# EAGLE design kiwi-basic (EAGLE 7.4.0)
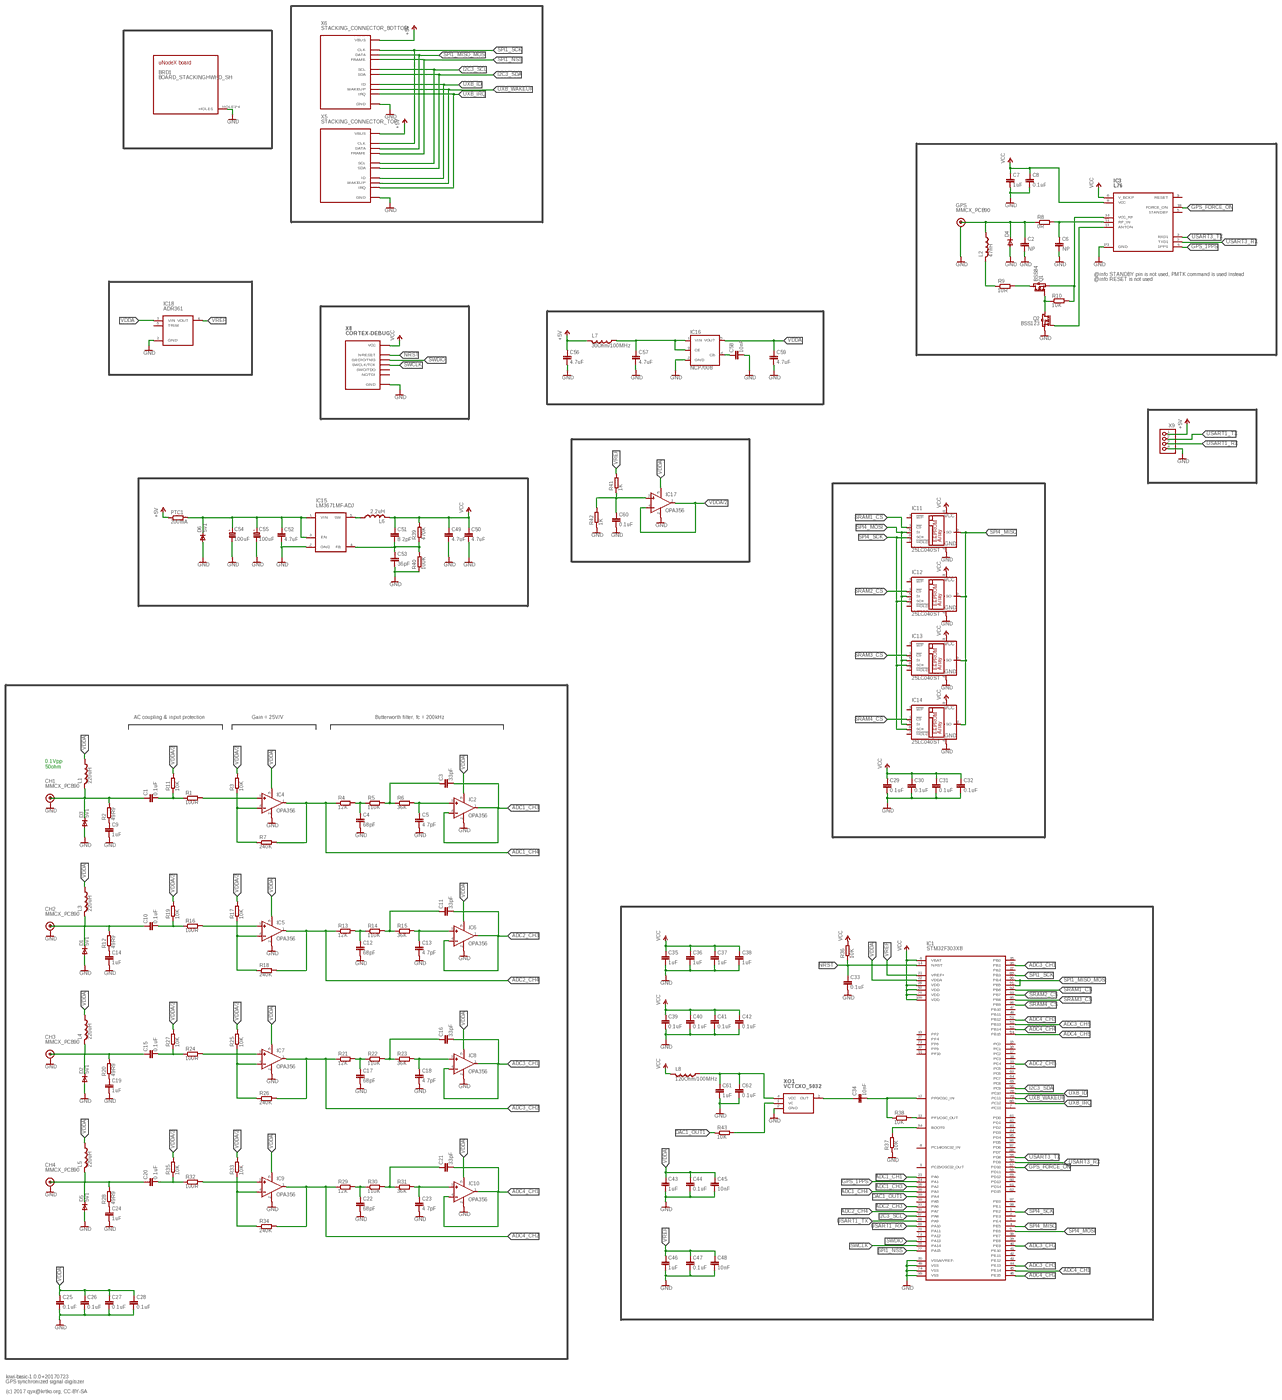
[diagram p0: schematic, sheet 1, overview]
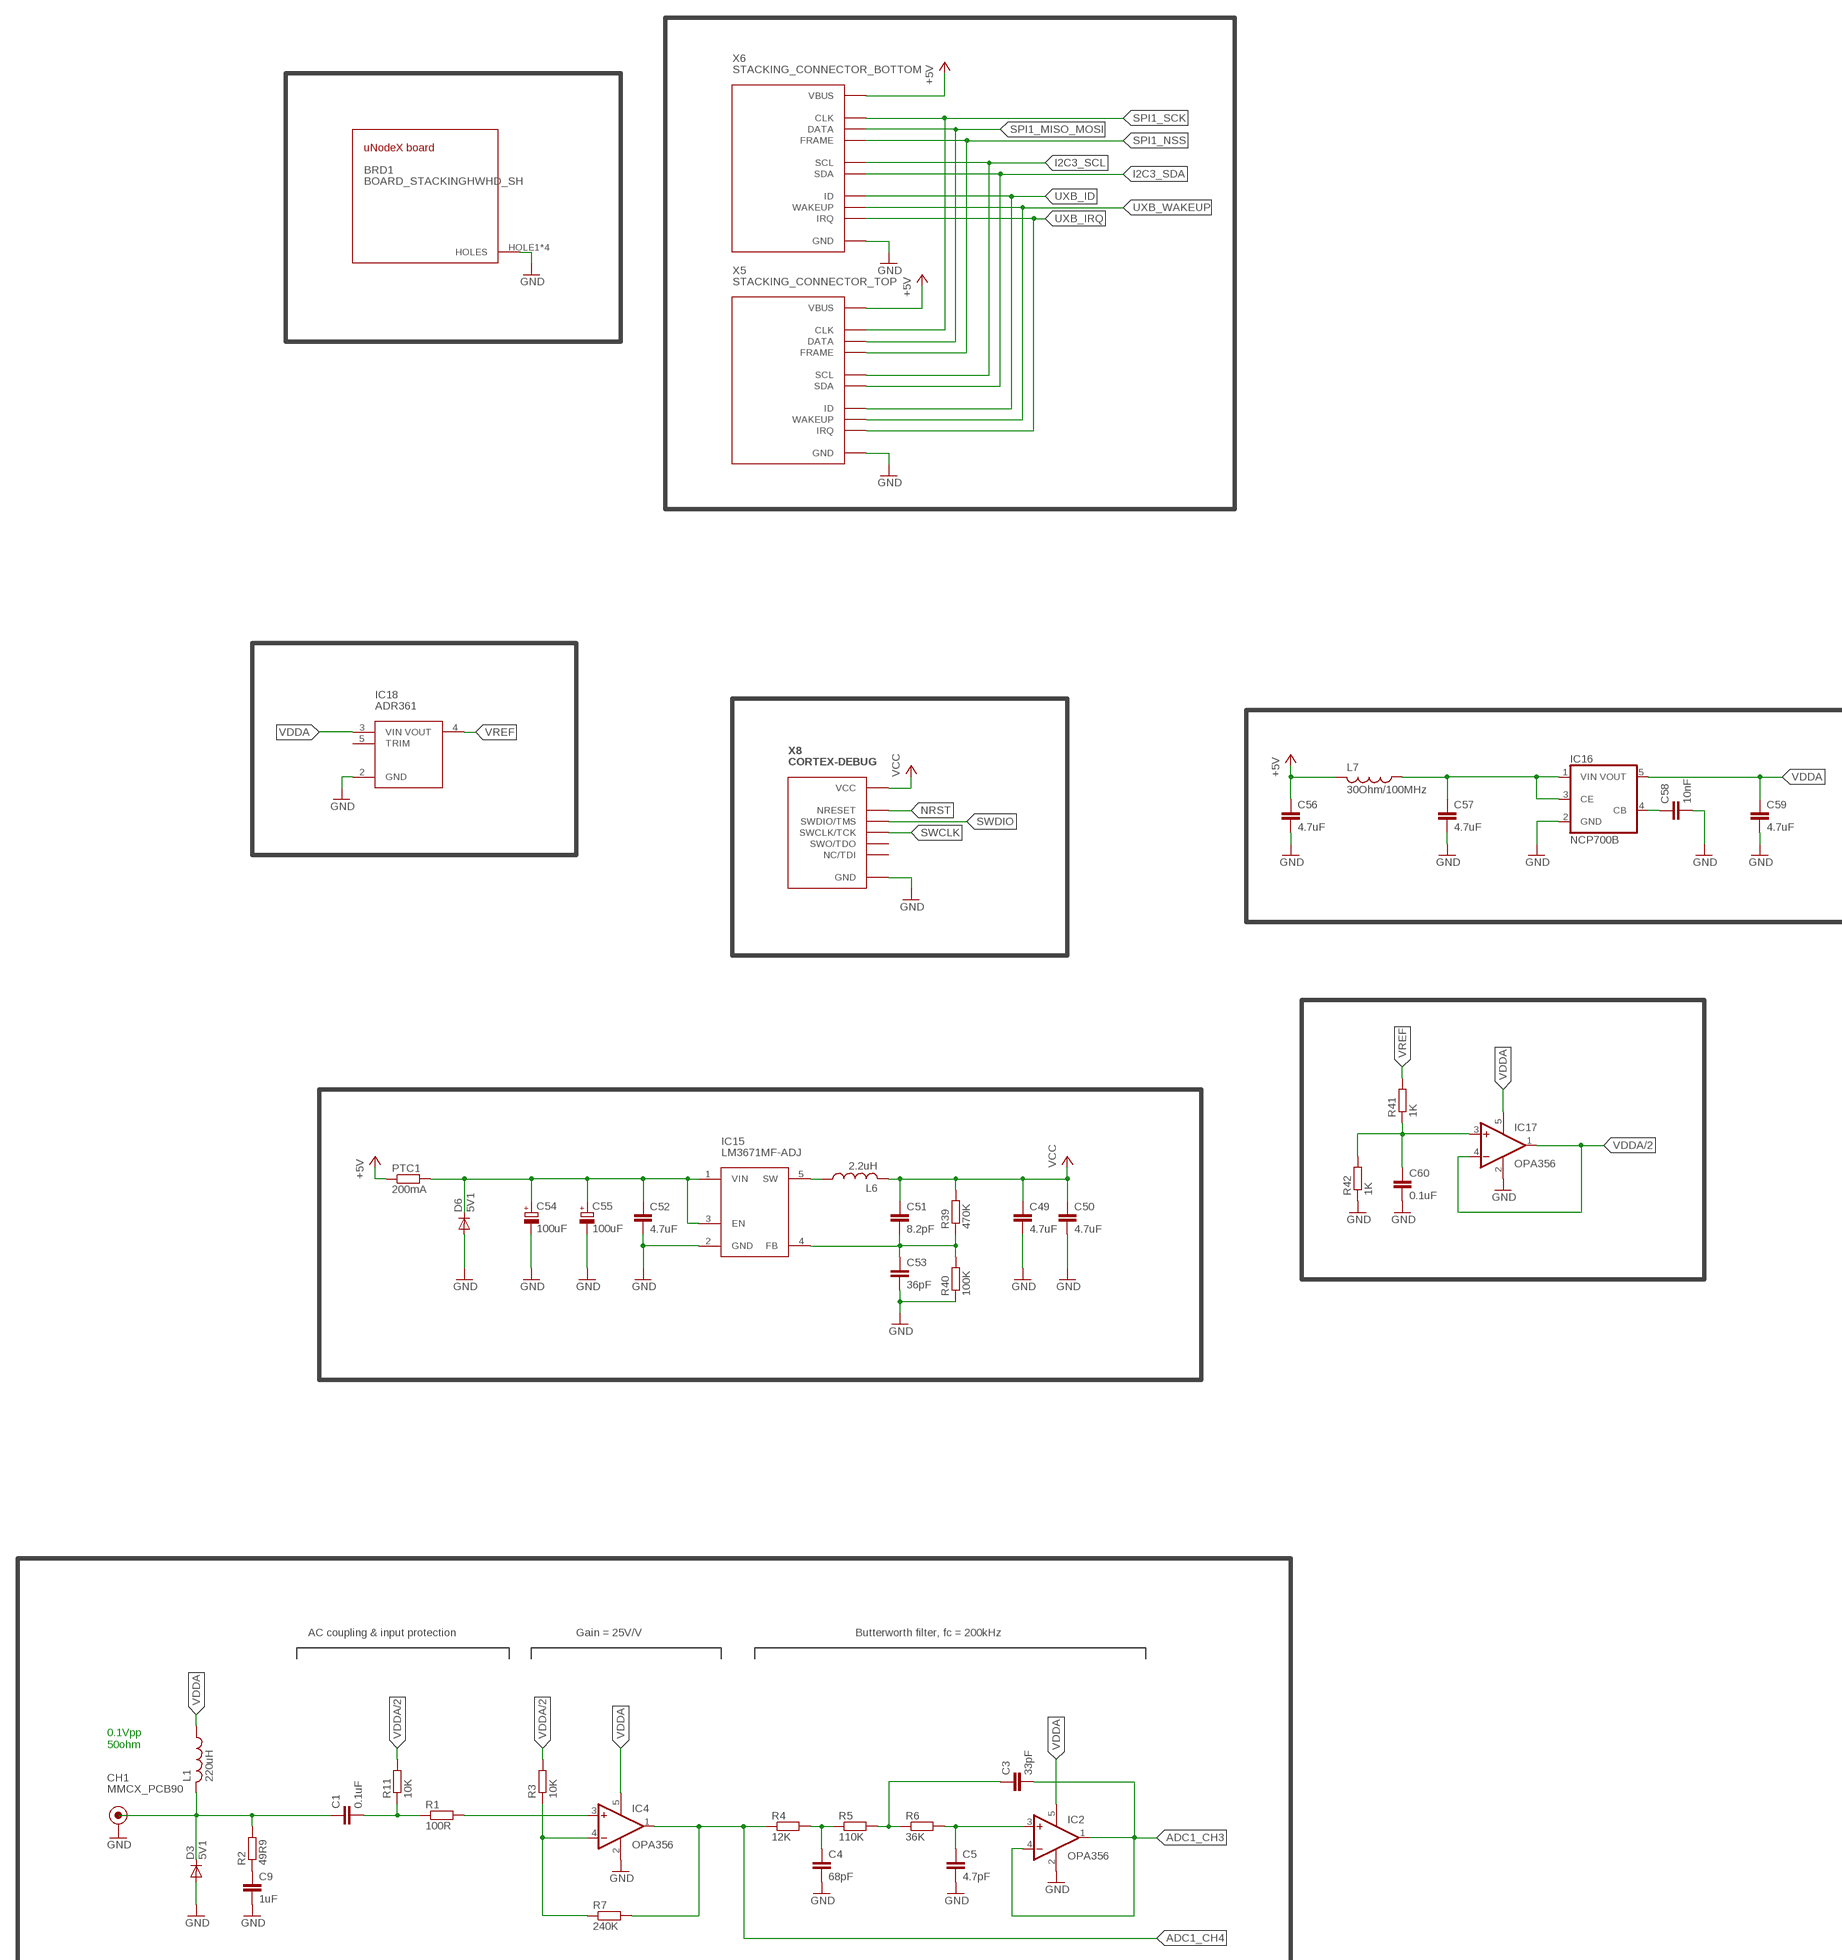
[diagram p1: schematic, sheet 1, part 1 of 4]
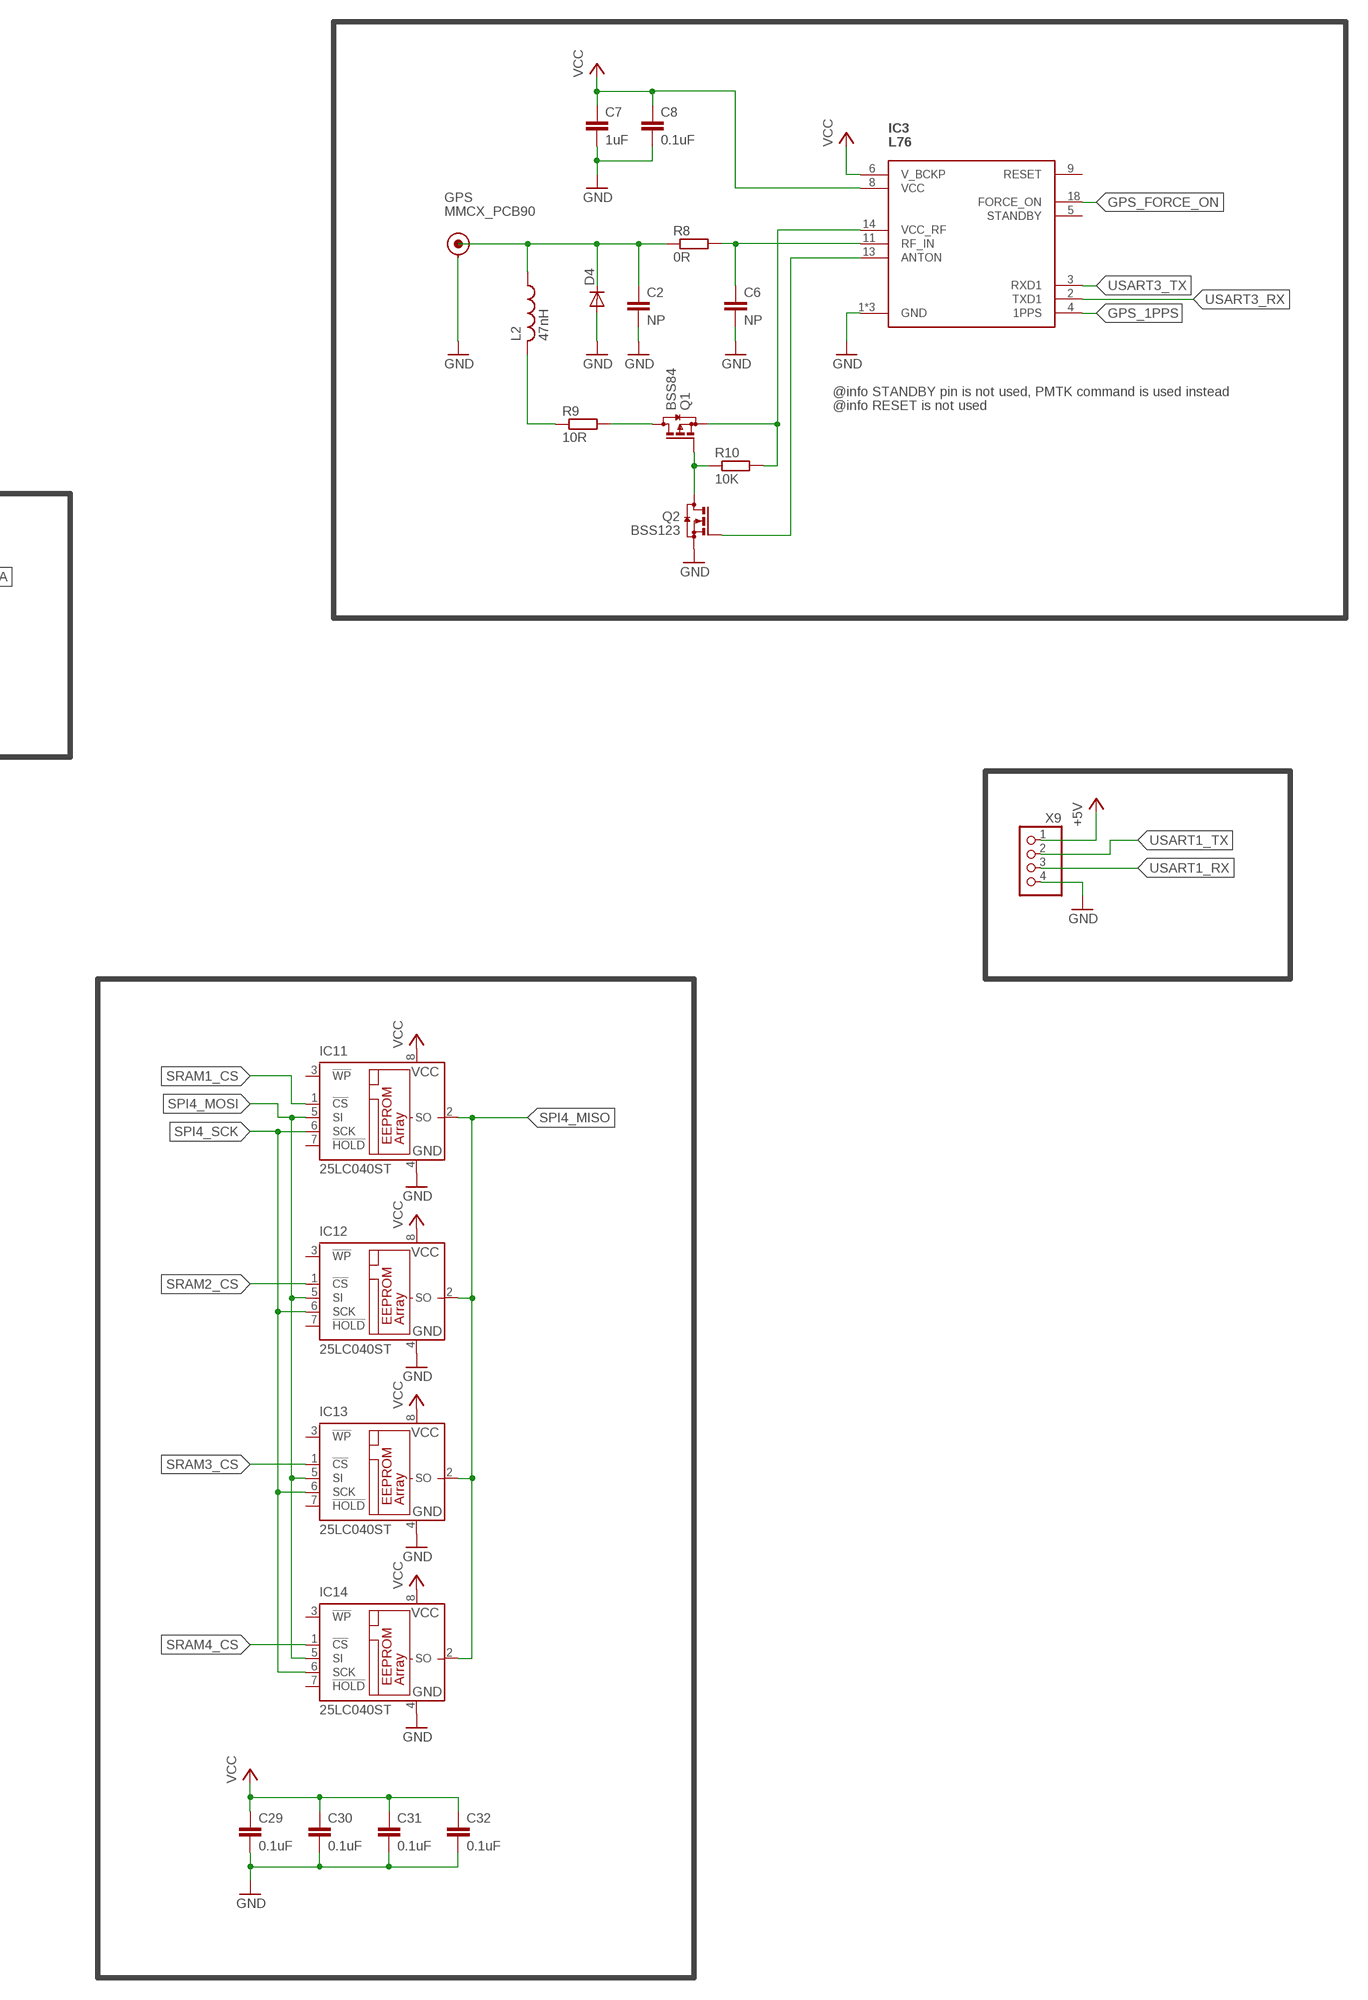
[diagram p2: schematic, sheet 1, part 2 of 4]
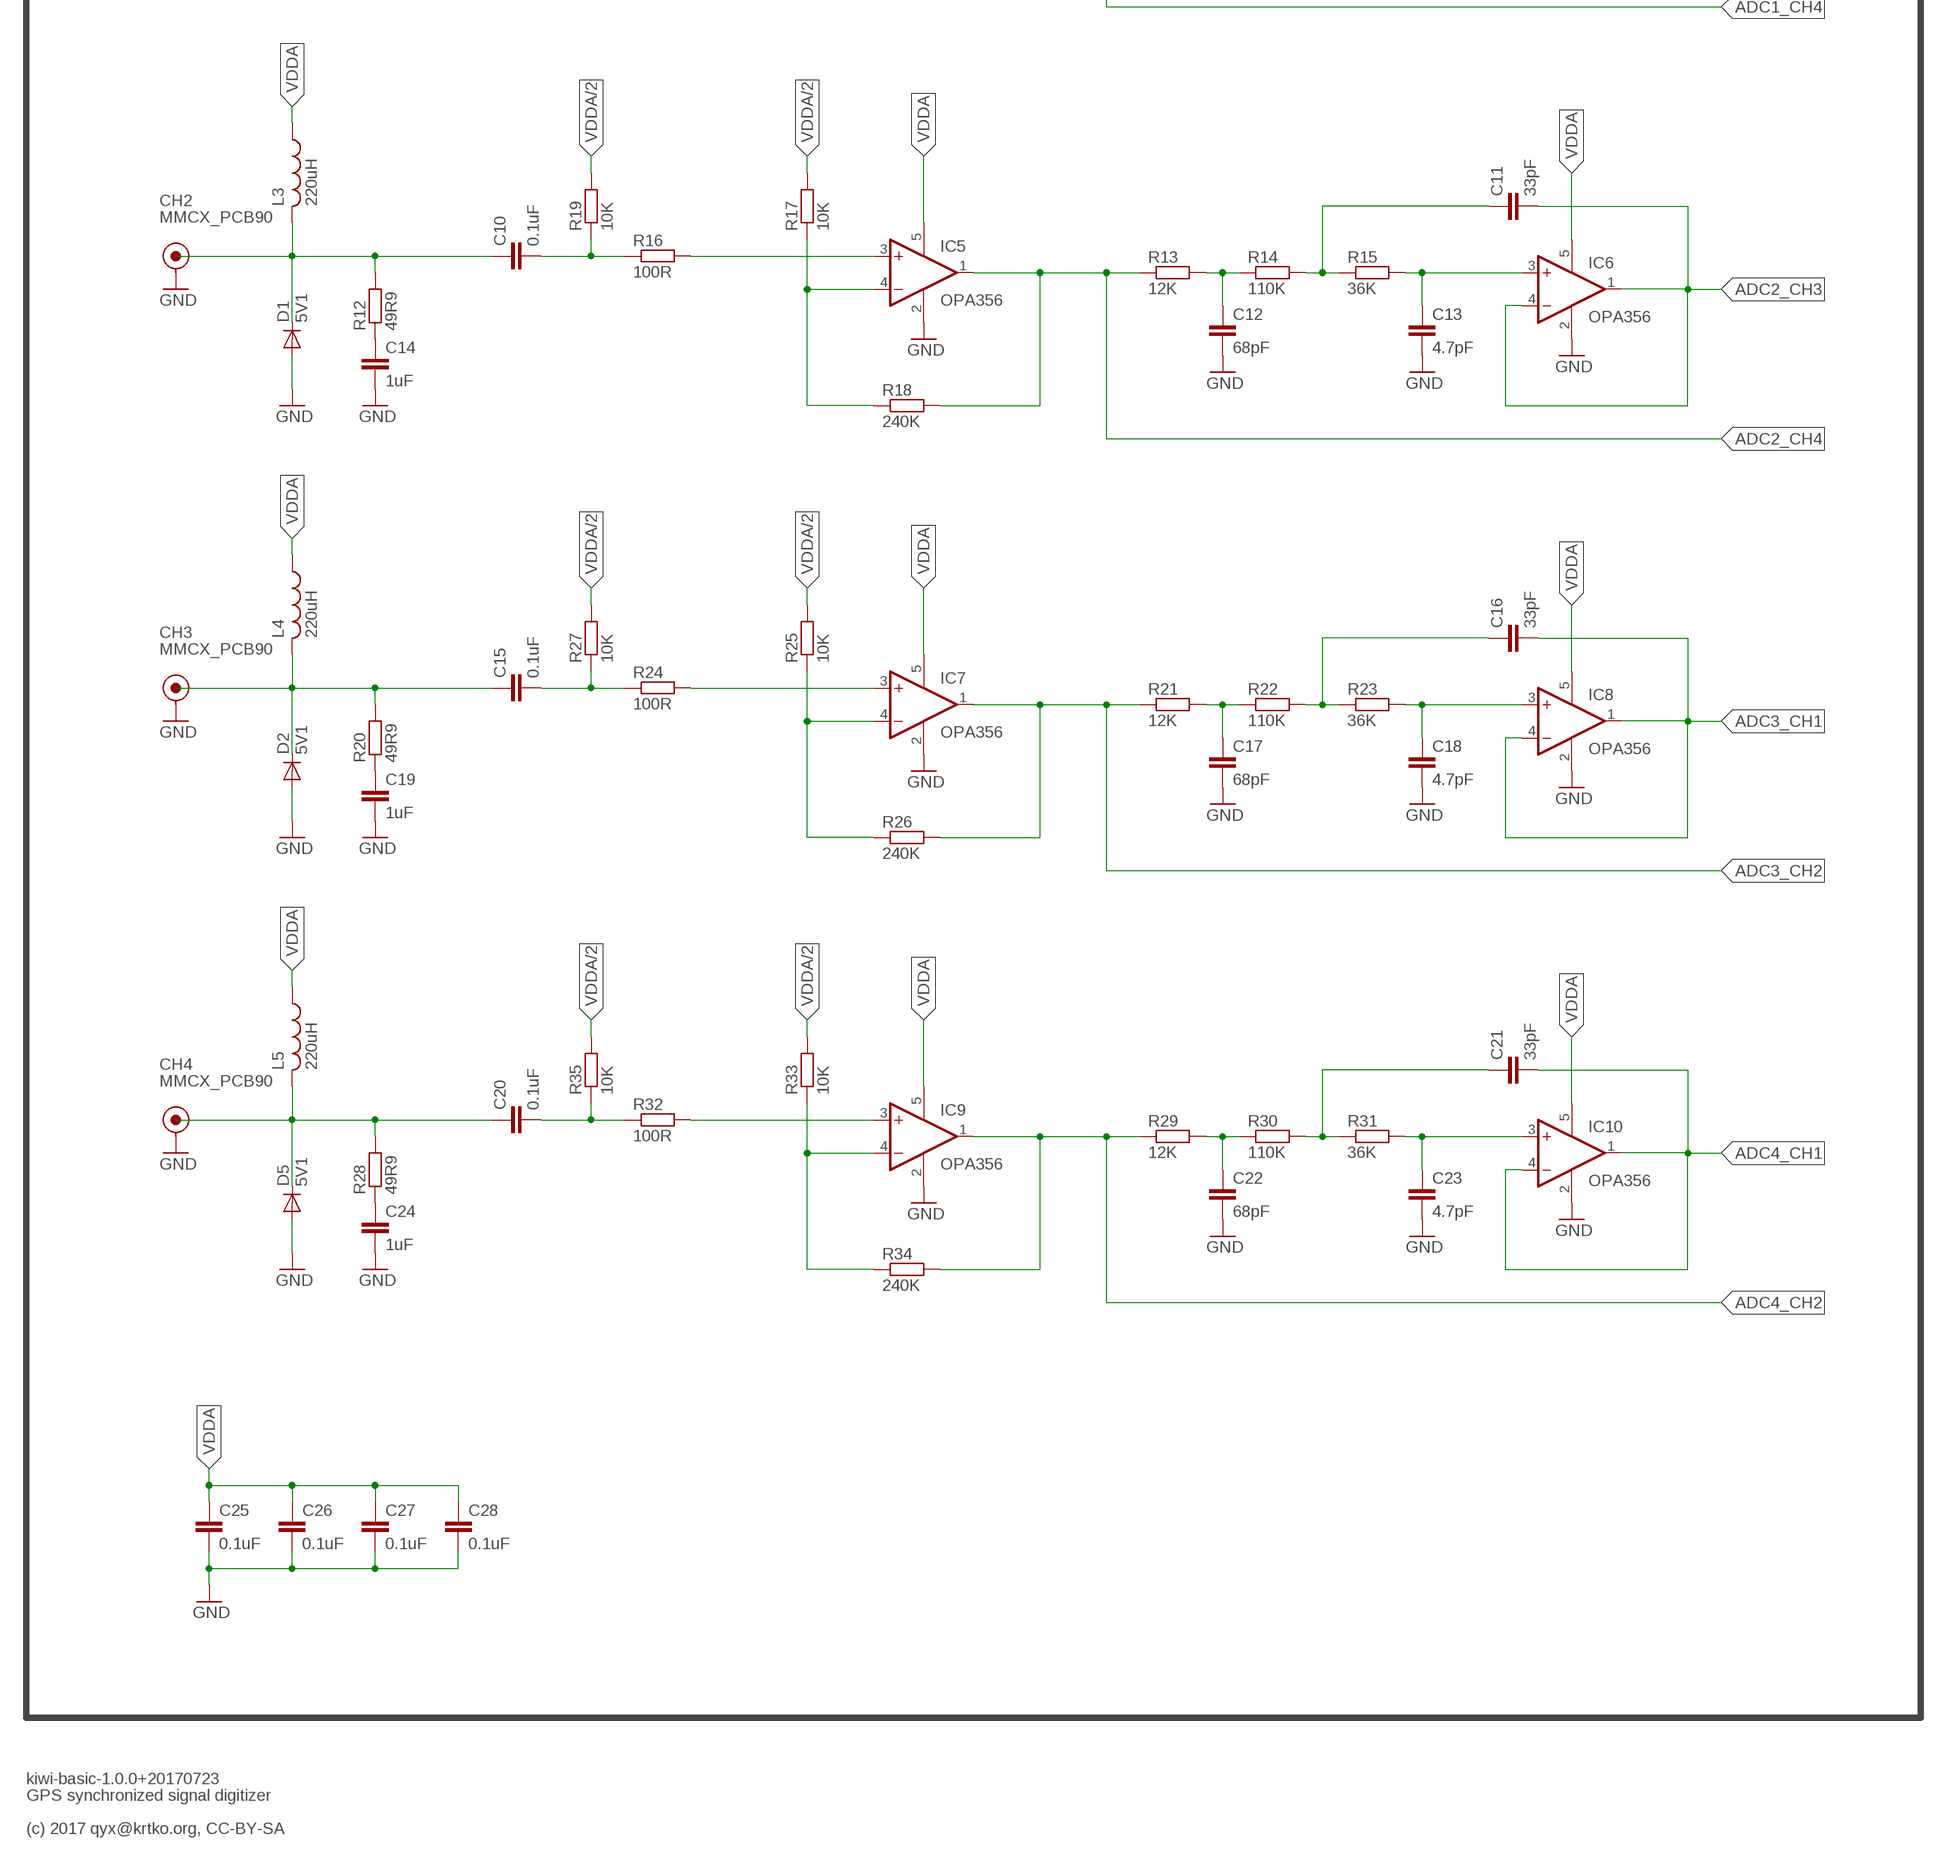
[diagram p3: schematic, sheet 1, part 3 of 4]
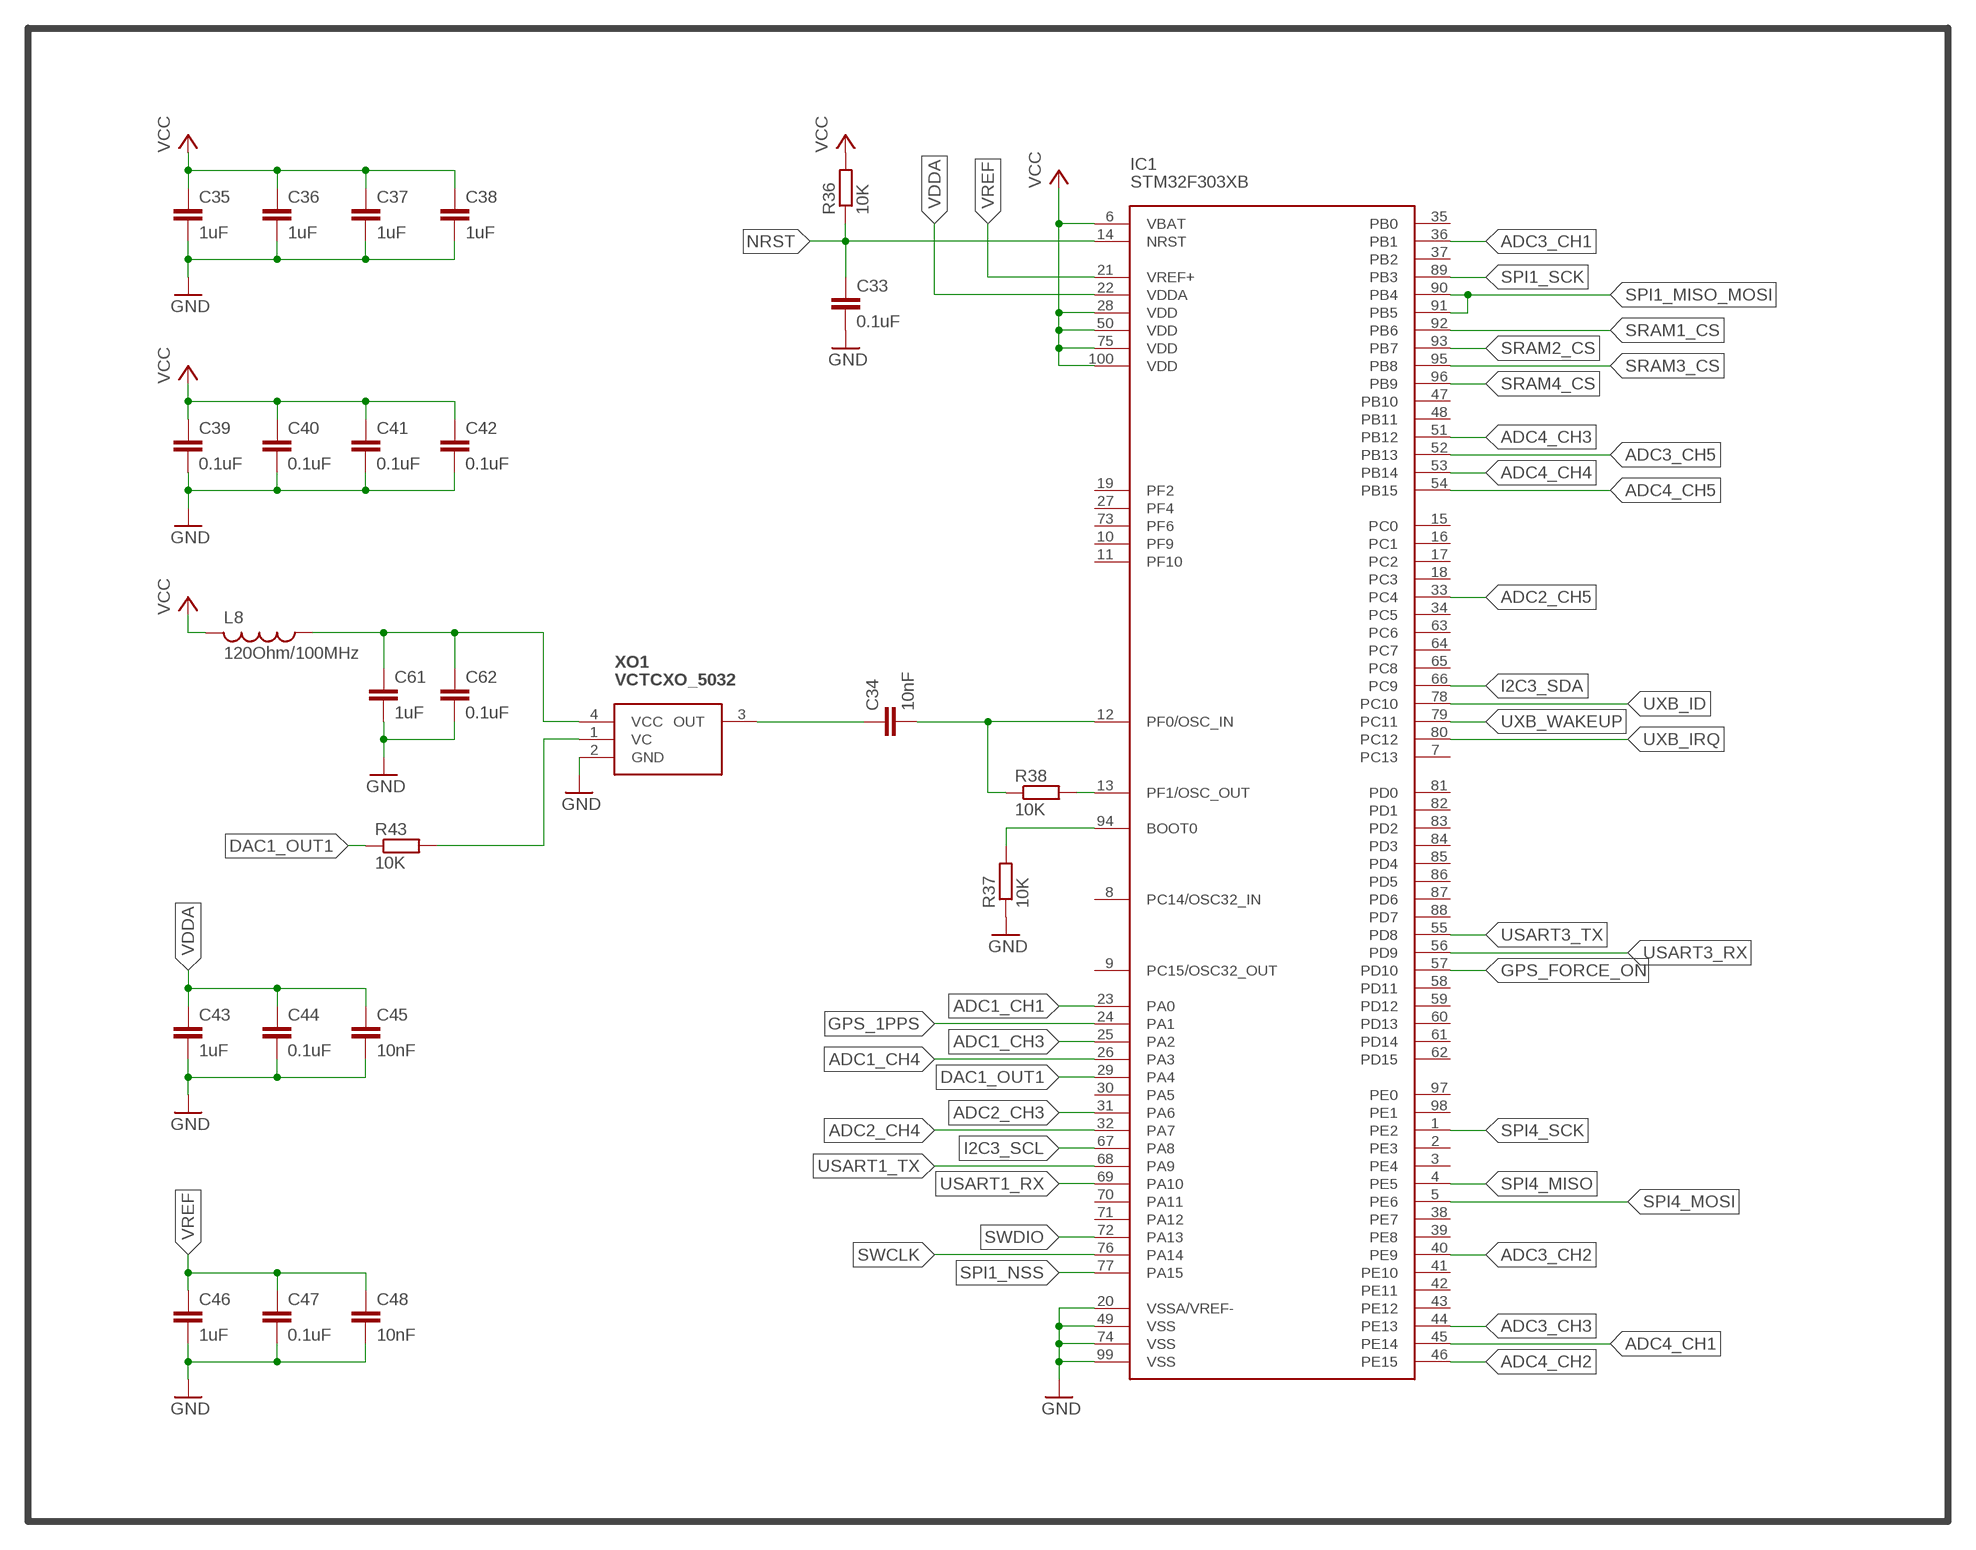
[diagram p4: schematic, sheet 1, part 4 of 4]

## Parts
BRD1  BOARD_STACKINGHWHD_SH  [HWHD_SHARP_CORNERS]
C1  0.1uF  C-EUC0603  [C0603]
C2  NP  C-EUC0603  [C0603]
C3  33pF  C-EUC0603  [C0603]
C4  68pF  C-EUC0603  [C0603]
C5  4.7pF  C-EUC0603  [C0603]
C6  NP  C-EUC0603  [C0603]
C7  1uF  C-EUC0603  [C0603]
C8  0.1uF  C-EUC0603  [C0603]
C9  1uF  C-EUC0603  [C0603]
C10  0.1uF  C-EUC0603  [C0603]
C11  33pF  C-EUC0603  [C0603]
C12  68pF  C-EUC0603  [C0603]
C13  4.7pF  C-EUC0603  [C0603]
C14  1uF  C-EUC0603  [C0603]
C15  0.1uF  C-EUC0603  [C0603]
C16  33pF  C-EUC0603  [C0603]
C17  68pF  C-EUC0603  [C0603]
C18  4.7pF  C-EUC0603  [C0603]
C19  1uF  C-EUC0603  [C0603]
C20  0.1uF  C-EUC0603  [C0603]
C21  33pF  C-EUC0603  [C0603]
C22  68pF  C-EUC0603  [C0603]
C23  4.7pF  C-EUC0603  [C0603]
C24  1uF  C-EUC0603  [C0603]
C25  0.1uF  C-EUC0603  [C0603]
C26  0.1uF  C-EUC0603  [C0603]
C27  0.1uF  C-EUC0603  [C0603]
C28  0.1uF  C-EUC0603  [C0603]
C29  0.1uF  C-EUC0603  [C0603]
C30  0.1uF  C-EUC0603  [C0603]
C31  0.1uF  C-EUC0603  [C0603]
C32  0.1uF  C-EUC0603  [C0603]
C33  0.1uF  C-EUC0603  [C0603]
C34  10nF  C-EUC0603  [C0603]
C35  1uF  C-EUC0603  [C0603]
C36  1uF  C-EUC0603  [C0603]
C37  1uF  C-EUC0603  [C0603]
C38  1uF  C-EUC0603  [C0603]
C39  0.1uF  C-EUC0603  [C0603]
C40  0.1uF  C-EUC0603  [C0603]
C41  0.1uF  C-EUC0603  [C0603]
C42  0.1uF  C-EUC0603  [C0603]
C43  1uF  C-EUC0603  [C0603]
C44  0.1uF  C-EUC0603  [C0603]
C45  10nF  C-EUC0603  [C0603]
C46  1uF  C-EUC0603  [C0603]
C47  0.1uF  C-EUC0603  [C0603]
C48  10nF  C-EUC0603  [C0603]
C49  4.7uF  C-EUC0805  [C0805]
C50  4.7uF  C-EUC0805  [C0805]
C51  8.2pF  C-EUC0603  [C0603]
C52  4.7uF  C-EUC0805  [C0805]
C53  36pF  C-EUC0603  [C0603]
C54  100uF  CPOL-EUD  [PANASONIC_D]
C55  100uF  CPOL-EUD  [PANASONIC_D]
C56  4.7uF  C-EUC0805  [C0805]
C57  4.7uF  C-EUC0805  [C0805]
C58  10nF  C-EUC0603  [C0603]
C59  4.7uF  C-EUC0805  [C0805]
C60  0.1uF  C-EUC0603  [C0603]
C61  1uF  C-EUC0603  [C0603]
C62  0.1uF  C-EUC0603  [C0603]
CH1  MMCX_PCB90  [MMCX_PCB_90]
CH2  MMCX_PCB90  [MMCX_PCB_90]
CH3  MMCX_PCB90  [MMCX_PCB_90]
CH4  MMCX_PCB90  [MMCX_PCB_90]
D1  5V1  DIODE-SOD323-W  [SOD323-W]
D2  5V1  DIODE-SOD323-W  [SOD323-W]
D3  5V1  DIODE-SOD323-W  [SOD323-W]
D4  DIODE-SOD323-W  [SOD323-W]
D5  5V1  DIODE-SOD323-W  [SOD323-W]
D6  5V1  DIODE-SOD323-W  [SOD323-W]
GPS  MMCX_PCB90  [MMCX_PCB_90]
IC1  STM32F303XB  [TQFP100]
IC2  OPA356  MCP601OT  [SOT23-5]
IC3  L76  [L76]
IC4  OPA356  MCP601OT  [SOT23-5]
IC5  OPA356  MCP601OT  [SOT23-5]
IC6  OPA356  MCP601OT  [SOT23-5]
IC7  OPA356  MCP601OT  [SOT23-5]
IC8  OPA356  MCP601OT  [SOT23-5]
IC9  OPA356  MCP601OT  [SOT23-5]
IC10  OPA356  MCP601OT  [SOT23-5]
IC11  25LC040ST  [TSSOP8]
IC12  25LC040ST  [TSSOP8]
IC13  25LC040ST  [TSSOP8]
IC14  25LC040ST  [TSSOP8]
IC15  LM3671MF-ADJ  LM3671MF  [SOT23-5]
IC16  NCP700B  TS520530  [SOT25]
IC17  OPA356  MCP601OT  [SOT23-5]
IC18  ADR361  [SOT23-5]
L1  220uH  L-USL2012C  [L2012C]
L2  47nH  L-USL2012C  [L2012C]
L3  220uH  L-USL2012C  [L2012C]
L4  220uH  L-USL2012C  [L2012C]
L5  220uH  L-USL2012C  [L2012C]
L6  2.2uH  L-USL2825P  [L2825P]
L7  30Ohm/100MHz  L-USL2012C  [L2012C]
L8  120Ohm/100MHz  L-USL2012C  [L2012C]
PTC1  200mA  R-EU_R1206  [R1206]
Q1  BSS84  [SOT23]
Q2  BSS123  [SOT23]
R1  100R  R-EU_R0603  [R0603]
R2  49R9  R-EU_R0603  [R0603]
R3  10K  R-EU_R0603  [R0603]
R4  12K  R-EU_R0603  [R0603]
R5  110K  R-EU_R0603  [R0603]
R6  36K  R-EU_R0603  [R0603]
R7  240K  R-EU_R0603  [R0603]
R8  0R  R-EU_R0603  [R0603]
R9  10R  R-EU_R0603  [R0603]
R10  10K  R-EU_R0603  [R0603]
R11  10K  R-EU_R0603  [R0603]
R12  49R9  R-EU_R0603  [R0603]
R13  12K  R-EU_R0603  [R0603]
R14  110K  R-EU_R0603  [R0603]
R15  36K  R-EU_R0603  [R0603]
R16  100R  R-EU_R0603  [R0603]
R17  10K  R-EU_R0603  [R0603]
R18  240K  R-EU_R0603  [R0603]
R19  10K  R-EU_R0603  [R0603]
R20  49R9  R-EU_R0603  [R0603]
R21  12K  R-EU_R0603  [R0603]
R22  110K  R-EU_R0603  [R0603]
R23  36K  R-EU_R0603  [R0603]
R24  100R  R-EU_R0603  [R0603]
R25  10K  R-EU_R0603  [R0603]
R26  240K  R-EU_R0603  [R0603]
R27  10K  R-EU_R0603  [R0603]
R28  49R9  R-EU_R0603  [R0603]
R29  12K  R-EU_R0603  [R0603]
R30  110K  R-EU_R0603  [R0603]
R31  36K  R-EU_R0603  [R0603]
R32  100R  R-EU_R0603  [R0603]
R33  10K  R-EU_R0603  [R0603]
R34  240K  R-EU_R0603  [R0603]
R35  10K  R-EU_R0603  [R0603]
R36  10K  R-EU_R0603  [R0603]
R37  10K  R-EU_R0603  [R0603]
R38  10K  R-EU_R0603  [R0603]
R39  470K  R-EU_R0603  [R0603]
R40  100K  R-EU_R0603  [R0603]
R41  1K  R-EU_R0603  [R0603]
R42  1K  R-EU_R0603  [R0603]
R43  10K  R-EU_R0603  [R0603]
X5  STACKING_CONNECTOR_TOP  [HAR-FLEX-TOP-12P]
X6  STACKING_CONNECTOR_BOTTOM  [HAR-FLEX-BOTTOM-12P]
X8  CORTEX-DEBUG  [CORTEX-DEBUG]
X9  PINHD-1X4  [1X04]
XO1  VCTCXO_5032  [XTAL_5032]

## Nets
+5V: C56.1 L7.2 PTC1.1 X5.VBUS X6.VBUS X9.1
ADC1_CH1: IC1.23(PA0)
ADC1_CH3: C3.2 IC1.25(PA2) IC2.1(OUT) IC2.4(-IN)
ADC1_CH4: IC1.26(PA3) IC4.1(OUT) R4.1 R7.2
ADC2_CH3: C11.2 IC1.31(PA6) IC6.1(OUT) IC6.4(-IN)
ADC2_CH4: IC1.32(PA7) IC5.1(OUT) R13.1 R18.2
ADC2_CH5: IC1.33(PC4)
ADC3_CH1: C16.2 IC1.36(PB1) IC8.1(OUT) IC8.4(-IN)
ADC3_CH2: IC1.40(PE9) IC7.1(OUT) R21.1 R26.2
ADC3_CH3: IC1.44(PE13)
ADC3_CH5: IC1.52(PB13)
ADC4_CH1: C21.2 IC1.45(PE14) IC10.1(OUT) IC10.4(-IN)
ADC4_CH2: IC1.46(PE15) IC9.1(OUT) R29.1 R34.2
ADC4_CH3: IC1.51(PB12)
ADC4_CH4: IC1.53(PB14)
ADC4_CH5: IC1.54(PB15)
DAC1_OUT1: IC1.29(PA4) R43.1
GND: BRD1.HOLE1(HOLES) BRD1.HOLE2(HOLES) BRD1.HOLE3(HOLES) BRD1.HOLE4(HOLES) C2.2 C4.2 C5.2 C6.2 C7.2 C8.2 C9.2 C12.2 C13.2 C14.2 C17.2 C18.2 C19.2 C22.2 C23.2 C24.2 C25.2 C26.2 C27.2 C28.2 C29.2 C30.2 C31.2 C32.2 C33.2 C35.2 C36.2 C37.2 C38.2 C39.2 C40.2 C41.2 C42.2 C43.2 C44.2 C45.2 C46.2 C47.2 C48.2 C49.2 C50.2 C52.2 C53.2 C54.- C55.- C56.2 C57.2 C58.2 C59.2 C60.2 C61.2 C62.2 CH1.S1(SHIELD) CH1.S2(SHIELD) CH1.S3(SHIELD) CH1.S4(SHIELD) CH2.S1(SHIELD) CH2.S2(SHIELD) CH2.S3(SHIELD) CH2.S4(SHIELD) CH3.S1(SHIELD) CH3.S2(SHIELD) CH3.S3(SHIELD) CH3.S4(SHIELD) CH4.S1(SHIELD) CH4.S2(SHIELD) CH4.S3(SHIELD) CH4.S4(SHIELD) D1.A D2.A D3.A D4.A D5.A D6.A GPS.S1(SHIELD) GPS.S2(SHIELD) GPS.S3(SHIELD) GPS.S4(SHIELD) IC1.20(VSSA/VREF-) IC1.49(VSS) IC1.74(VSS) IC1.99(VSS) IC2.2(V-) IC3.1(GND) IC3.10(GND) IC3.12(GND) IC4.2(V-) IC5.2(V-) IC6.2(V-) IC7.2(V-) IC8.2(V-) IC9.2(V-) IC10.2(V-) IC11.4(GND) IC12.4(GND) IC13.4(GND) IC14.4(GND) IC15.2(GND) IC16.2(GND) IC17.2(V-) IC18.2(GND) Q2.2(S) R37.1 R40.1 R42.1 X5.GND1(GND) X5.GND2(GND) X5.GND3(GND) X5.H1(GND) X5.H2(GND) X5.H3(GND) X5.H4(GND) X6.GND1(GND) X6.GND2(GND) X6.GND3(GND) X6.H1(GND) X6.H2(GND) X6.H3(GND) X6.H4(GND) X8.GND1(GND) X8.GND2(GND) X8.GND_DETECT(GND) X9.4 XO1.2(GND)
GPS_1PPS: IC1.24(PA1) IC3.4(1PPS)
GPS_FORCE_ON: IC1.57(PD10) IC3.18(FORCE_ON)
I2C3_SCL: IC1.67(PA8) X5.SCL X6.SCL
I2C3_SDA: IC1.66(PC9) X5.SDA X6.SDA
N$1: C9.1 R2.1
N$2: IC4.3(+IN) R1.2
N$3: C1.1 CH1.C(CENTER) D3.C L1.2 R2.2
N$4: C1.2 R1.1 R11.1
N$5: C4.1 R4.2 R5.1
N$6: C3.1 R5.2 R6.1
N$7: C5.1 IC2.3(+IN) R6.2
N$8: IC4.4(-IN) R3.1 R7.1
N$9: C10.1 CH2.C(CENTER) D1.C L3.2 R12.2
N$10 [gps]: C2.1 D4.C GPS.C(CENTER) L2.1 R8.1
N$11 [gps]: C6.1 IC3.11(RF_IN) R8.2
N$12: L2.2 R9.1
N$13: IC3.14(VCC_RF) Q1.2(S) R10.2
N$14: Q1.3(D) R9.2
N$15: Q1.1(G) Q2.3(D) R10.1
N$16: IC3.13(ANTON) Q2.1(G)
N$17: C12.1 R13.2 R14.1
N$18: C11.1 R14.2 R15.1
N$19: C13.1 IC6.3(+IN) R15.2
N$20: IC5.4(-IN) R17.1 R18.1
N$21: IC5.3(+IN) R16.2
N$22: C14.1 R12.1
N$23: C10.2 R16.1 R19.1
N$24: C15.1 CH3.C(CENTER) D2.C L4.2 R20.2
N$25: C17.1 R21.2 R22.1
N$26: C16.1 R22.2 R23.1
N$27: C18.1 IC8.3(+IN) R23.2
N$28: IC7.4(-IN) R25.1 R26.1
N$29: IC7.3(+IN) R24.2
N$30: C19.1 R20.1
N$31: C15.2 R24.1 R27.1
N$32: C20.1 CH4.C(CENTER) D5.C L5.2 R28.2
N$33: C22.1 R29.2 R30.1
N$34: C21.1 R30.2 R31.1
N$35: C23.1 IC10.3(+IN) R31.2
N$36: IC9.4(-IN) R33.1 R34.1
N$37: IC9.3(+IN) R32.2
N$38: C24.1 R28.1
N$39: C20.2 R32.1 R35.1
N$40: IC1.94(BOOT0) R37.2
N$41: IC1.13(PF1/OSC_OUT) R38.2
N$42: C51.2 C53.1 IC15.4(FB) R39.1 R40.2
N$43: IC15.5(SW) L6.1
N$44: C57.1 IC16.1(VIN) IC16.3(CE) L7.1
N$45: C58.1 IC16.4(CB)
N$46: C60.1 IC17.3(+IN) R41.1 R42.2
N$47: C34.1 XO1.3(OUT)
N$48: C61.1 C62.1 L8.1 XO1.4(VCC)
N$49: R43.2 XO1.1(VC)
NRST: C33.1 IC1.14(NRST) R36.1 X8.NRESET
SPI1_MISO_MOSI: IC1.90(PB4) IC1.91(PB5) X5.DATA X6.DATA
SPI1_NSS: IC1.77(PA15) X5.FRAME X6.FRAME
SPI1_SCK: IC1.89(PB3) X5.CLK X6.CLK
SPI4_MISO: IC1.4(PE5) IC11.2(SO) IC12.2(SO) IC13.2(SO) IC14.2(SO)
SPI4_MOSI: IC1.5(PE6) IC11.5(SI) IC12.5(SI) IC13.5(SI) IC14.5(SI)
SPI4_SCK: IC1.1(PE2) IC11.6(SCK) IC12.6(SCK) IC13.6(SCK) IC14.6(SCK)
SRAM1_CS: IC1.92(PB6) IC11.1(!CS)
SRAM2_CS: IC1.93(PB7) IC12.1(!CS)
SRAM3_CS: IC1.95(PB8) IC13.1(!CS)
SRAM4_CS: IC1.96(PB9) IC14.1(!CS)
SWCLK: IC1.76(PA14) X8.SWCLK/TCK
SWDIO: IC1.72(PA13) X8.SWDIO/TMS
TCXO_CLK: C34.2 IC1.12(PF0/OSC_IN) R38.1
USART1_RX: IC1.69(PA10) X9.3
USART1_TX: IC1.68(PA9) X9.2
USART3_RX: IC1.56(PD9) IC3.2(TXD1)
USART3_TX: IC1.55(PD8) IC3.3(RXD1)
UXB_ID: IC1.78(PC10) X5.ID X6.ID
UXB_IRQ: IC1.80(PC12) X5.IRQ X6.IRQ
UXB_WAKEUP: IC1.79(PC11) X5.WAKEUP X6.WAKEUP
VBUS: C52.1 C54.+ C55.+ D6.C IC15.1(VIN) IC15.3(EN) PTC1.2
VCC: C7.1 C8.1 C29.1 C30.1 C31.1 C32.1 C35.1 C36.1 C37.1 C38.1 C39.1 C40.1 C41.1 C42.1 C49.1 C50.1 C51.1 IC1.6(VBAT) IC1.28(VDD) IC1.50(VDD) IC1.75(VDD) IC1.100(VDD) IC3.6(V_BCKP) IC3.8(VCC) IC11.8(VCC) IC12.8(VCC) IC13.8(VCC) IC14.8(VCC) L6.2 L8.2 R36.2 R39.2 X8.VCC
VDDA: C25.1 C26.1 C27.1 C28.1 C43.1 C44.1 C45.1 C59.1 IC1.22(VDDA) IC2.5(V+) IC4.5(V+) IC5.5(V+) IC6.5(V+) IC7.5(V+) IC8.5(V+) IC9.5(V+) IC10.5(V+) IC16.5(VOUT) IC17.5(V+) IC18.3(VIN) L1.1 L3.1 L4.1 L5.1
VDDA/2: IC17.1(OUT) IC17.4(-IN) R3.2 R11.2 R17.2 R19.2 R25.2 R27.2 R33.2 R35.2
VREF: C46.1 C47.1 C48.1 IC1.21(VREF+) IC18.4(VOUT) R41.2
Unconnected: IC1.2(PE3) IC1.3(PE4) IC1.7(PC13) IC1.8(PC14/OSC32_IN) IC1.9(PC15/OSC32_OUT) IC1.10(PF9) IC1.11(PF10) IC1.15(PC0) IC1.16(PC1) IC1.17(PC2) IC1.18(PC3) IC1.19(PF2) IC1.27(PF4) IC1.30(PA5) IC1.34(PC5) IC1.35(PB0) IC1.37(PB2) IC1.38(PE7) IC1.39(PE8) IC1.41(PE10) IC1.42(PE11) IC1.43(PE12) IC1.47(PB10) IC1.48(PB11) IC1.58(PD11) IC1.59(PD12) IC1.60(PD13) IC1.61(PD14) IC1.62(PD15) IC1.63(PC6) IC1.64(PC7) IC1.65(PC8) IC1.70(PA11) IC1.71(PA12) IC1.73(PF6) IC1.81(PD0) IC1.82(PD1) IC1.83(PD2) IC1.84(PD3) IC1.85(PD4) IC1.86(PD5) IC1.87(PD6) IC1.88(PD7) IC1.97(PE0) IC1.98(PE1) IC3.5(STANDBY) IC3.9(RESET) IC11.3(!WP) IC11.7(!HOLD) IC12.3(!WP) IC12.7(!HOLD) IC13.3(!WP) IC13.7(!HOLD) IC14.3(!WP) IC14.7(!HOLD) IC18.5(TRIM) X8.NC/TDI X8.SWO/TDO

## Notes on the sheet
- @info STANDBY pin is not used, PMTK command is used instead
- @info RESET is not used
- AC coupling & input protection | Gain = 25V/V | Butterworth filter, fc = 200kHz
- 0.1Vpp
  50ohm
- kiwi-basic-1.0.0+20170723
- GPS synchronized signal digitizer
- (c) 2017 qyx@krtko.org, CC-BY-SA

## Library data of the parts
BRD1 = unodex-boards:BOARD_STACKING
C1-C53 C56-C62 = rcl:C-EU: CAPACITOR, European symbol
C54 C55 = rcl:CPOL-EU: POLARIZED CAPACITOR, European symbol
CH1-CH4 GPS = con-coax:MMCX_PCB
D1-D6 = diode:DIODE-: DIODE
IC1 = stm32f303:STM32F303XB
IC2 IC4-IC10 IC17 = linear:MCP601: Single Op Amp 2.7V to 6.0V Single Supply CMOS Source: http://ww1.microchip.com/downloads/en/DeviceDoc/21314g.pdf
IC3 = gps_receivers:L76
IC11-IC14 = microchip:25*: Serial EEPROM 4K/ 8K , SPI bus; MF: MICROCHIP; MPN: 25LC040A-I/ST; OC_FARNELL: 1815998; OC_NEWARK: 72J3684
IC15 = qyx-misc:LM3671
IC16 = v-reg:TS5205: 150mA Low Noise LDO Voltage Regulator with Enable TSC [Taiwan Semiconductor Company, Ltd] Source: http://www.taiwansemi.com .. 5205_0409c.pdf
IC18 = voltage-references:ADR361
L1-L8 = rcl:L-US: INDUCTOR, American symbol
PTC1 R1-R43 = rcl:R-EU_: RESISTOR, European symbol
Q1 = transistor-small-signal:BSS84: P-CHANNEL MOS FET
Q2 = transistor-small-signal:BSS123: N-CHANNEL MOS FET
X5 = unodex-boards:STACKING_CONNECTOR_TOP
X6 = unodex-boards:STACKING_CONNECTOR_BOTTOM
X8 = debug-connectors:CORTEX-DEBUG
X9 = pinhead:PINHD-1X4: PIN HEADER
XO1 = crystals:VCTCXO_5032

## Net classes
0 default: width 0.2 mm, drill 0.3 mm, clearance 0.15 mm
1 gps: width 0.6 mm, clearance 0.6 mm

## Board
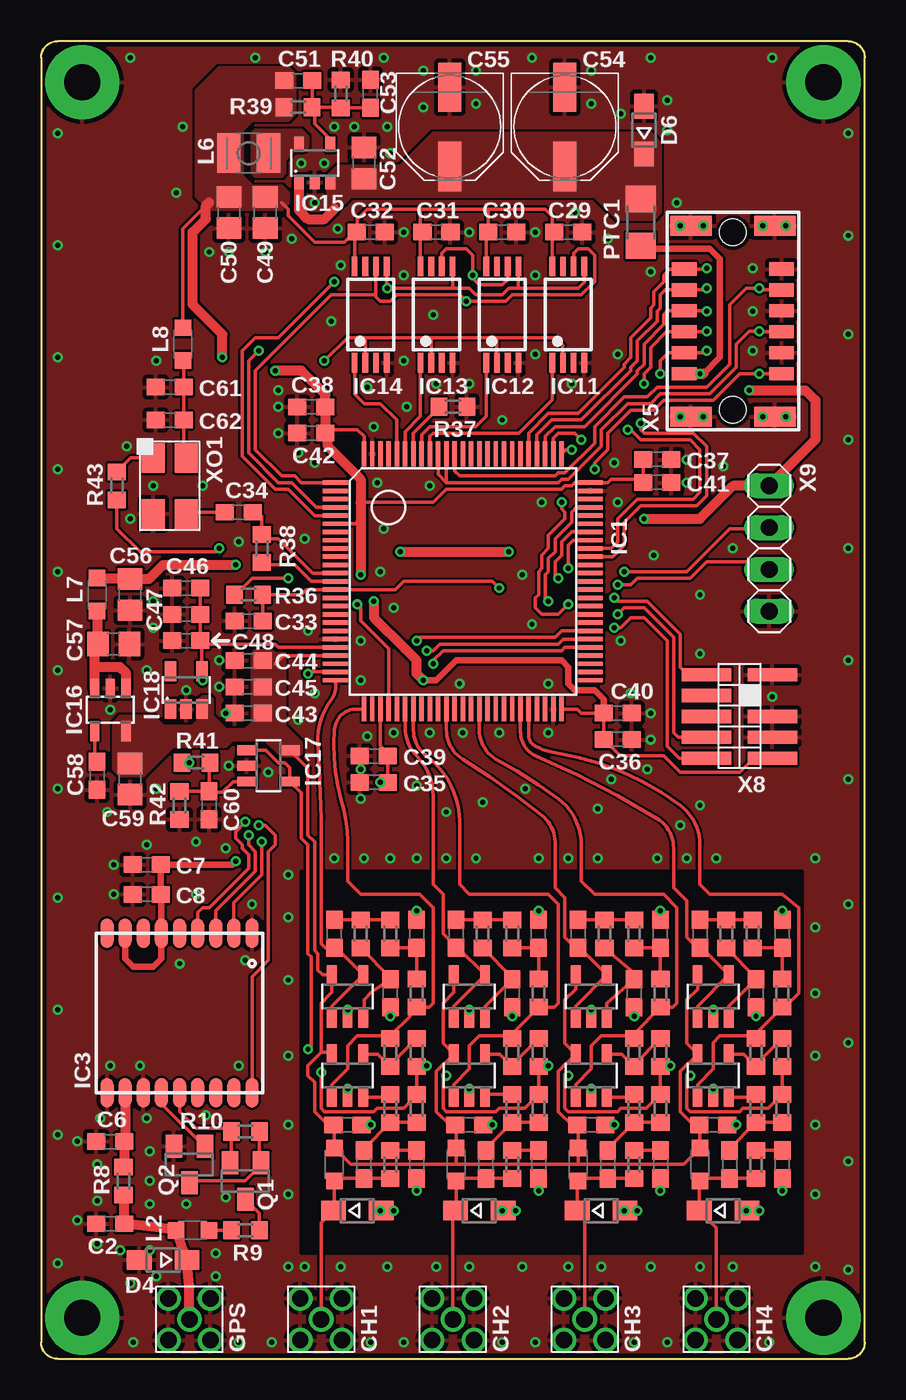
[diagram p5: board, top side]
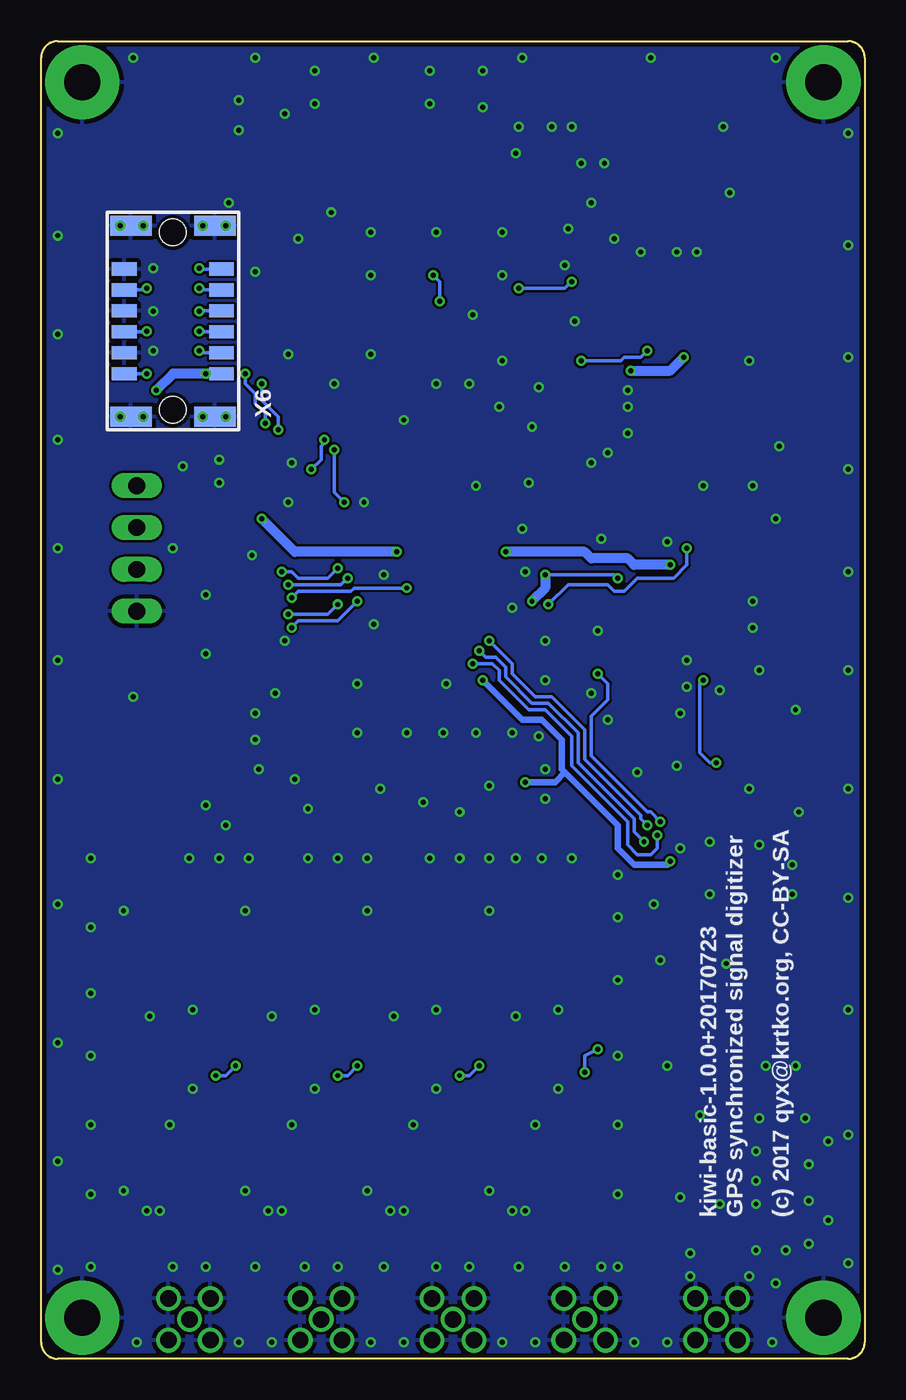
[diagram p6: board, bottom side, seen from below]

Size 50 x 80 mm. Coordinates in mm from the lower left corner, seen from the top.
Copper layers (1*16): Top 0.035mm / dielectric 1.5mm / Bottom 0.035mm
Design rules "seeed *": minimum track width 0.2mm, minimum drill 0.3mm, track to track 0.15mm, track to pad 0.15mm, pad to pad 0.15mm, via to via 0.15mm, smd to smd 0mil, copper to edge 10mil, drill to drill 10mil, minimum pad ring 6mil, minimum via ring 6mil, stop-mask expansion 2mil, vias tented up to drill 0.5mm, thermal gap 10mil
tRestrict: area 15.8,6.4 to 46.2,29.6

### Footprints (pad centres in the part's own frame; a part is rotated, then mirrored left to right if it is on the bottom)
HWHD_SHARP_CORNERS = drill 2.2 pad 4.5: HOLE1 2.5,2.5; HOLE2 47.5,2.5; HOLE3 47.5,77.5; HOLE4 2.5,77.5
C0603 = smd 1.1 x 1: 1 -0.85,0; 2 0.85,0
C0805 = smd 1.3 x 1.5: 1 -0.95,0; 2 0.95,0
PANASONIC_D = smd 3 x 1.4: + 2.4,0; - -2.4,0
MMCX_PCB_90 = drill 1: C 0,0; S1 -1.27,-1.27; S2 1.27,-1.27; S3 1.27,1.27; S4 -1.27,1.27
SOD323-W = smd 1.5 x 1.2: A 1.45,0; C -1.45,0
TQFP100 = smd 0.27 x 1.5: 1 -6,-7.75; 2 -5.5,-7.75; 3 -5,-7.75; 4 -4.5,-7.75; 5 -4,-7.75; 6 -3.5,-7.75; 7 -3,-7.75; 8 -2.5,-7.75; 9 -2,-7.75; 10 -1.5,-7.75; 11 -1,-7.75; 12 -0.5,-7.75; 13 0,-7.75; 14 0.5,-7.75; 15 1,-7.75; 16 1.5,-7.75; 17 2,-7.75; 18 2.5,-7.75; 19 3,-7.75; 20 3.5,-7.75; 21 4,-7.75; 22 4.5,-7.75; 23 5,-7.75; 24 5.5,-7.75; 25 6,-7.75; 51 6,7.75; 52 5.5,7.75; 53 5,7.75; 54 4.5,7.75; 55 4,7.75; 56 3.5,7.75; 57 3,7.75; 58 2.5,7.75; 59 2,7.75; 60 1.5,7.75; 61 1,7.75; 62 0.5,7.75; 63 0,7.75; 64 -0.5,7.75; 65 -1,7.75; 66 -1.5,7.75; 67 -2,7.75; 68 -2.5,7.75; 69 -3,7.75; 70 -3.5,7.75; 71 -4,7.75; 72 -4.5,7.75; 73 -5,7.75; 74 -5.5,7.75; 75 -6,7.75 | smd 1.5 x 0.27: 26 7.75,-6; 27 7.75,-5.5; 28 7.75,-5; 29 7.75,-4.5; 30 7.75,-4; 31 7.75,-3.5; 32 7.75,-3; 33 7.75,-2.5; 34 7.75,-2; 35 7.75,-1.5; 36 7.75,-1; 37 7.75,-0.5; 38 7.75,0; 39 7.75,0.5; 40 7.75,1; 41 7.75,1.5; 42 7.75,2; 43 7.75,2.5; 44 7.75,3; 45 7.75,3.5; 46 7.75,4; 47 7.75,4.5; 48 7.75,5; 49 7.75,5.5; 50 7.75,6; 76 -7.75,6; 77 -7.75,5.5; 78 -7.75,5; 79 -7.75,4.5; 80 -7.75,4; 81 -7.75,3.5; 82 -7.75,3; 83 -7.75,2.5; 84 -7.75,2; 85 -7.75,1.5; 86 -7.75,1; 87 -7.75,0.5; 88 -7.75,0; 89 -7.75,-0.5; 90 -7.75,-1; 91 -7.75,-1.5; 92 -7.75,-2; 93 -7.75,-2.5; 94 -7.75,-3; 95 -7.75,-3.5; 96 -7.75,-4; 97 -7.75,-4.5; 98 -7.75,-5; 99 -7.75,-5.5; 100 -7.75,-6
SOT23-5 = smd 0.6 x 1.2: 1 -0.95,-1.306; 2 0,-1.306; 3 0.95,-1.306; 4 0.95,1.306; 5 -0.95,1.306
L76 = smd 1.8 x 0.8: 1 4.85,-4.4; 2 4.85,-3.3; 3 4.85,-2.2; 4 4.85,-1.1; 5 4.85,0; 6 4.85,1.1; 7 4.85,2.2; 8 4.85,3.3; 9 4.85,4.4; 10 -4.85,4.4; 11 -4.85,3.3; 12 -4.85,2.2; 13 -4.85,1.1; 14 -4.85,0; 15 -4.85,-1.1; 16 -4.85,-2.2; 17 -4.85,-3.3; 18 -4.85,-4.4
TSSOP8 = smd 0.35 x 1.2: 1 -0.975,-2.925; 2 -0.325,-2.925; 3 0.325,-2.925; 4 0.975,-2.925; 5 0.975,2.925; 6 0.325,2.925; 7 -0.325,2.925; 8 -0.975,2.925
SOT23-5' = smd 0.6 x 0.9: 1 -0.95,-1.15; 2 0,-1.15; 3 0.95,-1.15; 4 0.95,1.15; 5 -0.95,1.15
SOT25 = smd 0.55 x 1.2: 1 -0.95,-1.3; 2 0,-1.3; 3 0.95,-1.3; 4 0.95,1.3; 5 -0.95,1.3
SOT23-5'' = smd 0.7 x 1.2: 1 -0.95,-1.15; 2 0,-1.15; 3 0.95,-1.15; 4 0.95,1.15; 5 -0.95,1.15
L2012C = smd 1 x 1: 1 -1,0; 2 1,0
L2825P = smd 1.4 x 2.4: 1 -1.2,0; 2 1.2,0
R1206 = smd 1.6 x 1.803: 1 -1.422,0; 2 1.422,0
SOT23 = smd 1 x 1.4: 1 -0.95,-1.1; 2 0.95,-1.1; 3 0,1.1
R0603 = smd 1 x 1.1: 1 -0.85,0; 2 0.85,0
HAR-FLEX-TOP-12P = smd 1.5 x 0.8: CLK -5.05,-15.105; DATA -5.05,-17.645; FRAME -5.05,-20.185; GND1 -5.05,-13.835; GND2 -5.05,-16.375; GND3 -5.05,-18.915; ID -10.95,-16.375; IRQ -10.95,-13.835; SCL -10.95,-17.645; SDA -10.95,-18.915; VBUS -10.95,-20.185; WAKEUP -10.95,-15.105 | smd 2.5 x 1.2: H1 -10.55,-22.8; H2 -5.45,-22.8; H3 -5.45,-11.2; H4 -10.55,-11.2 | hole 1.6: -8,-11.615; -8,-22.385
HAR-FLEX-BOTTOM-12P = smd 1.5 x 0.8 bottom: CLK -5.05,-15.105; DATA -5.05,-17.645; FRAME -5.05,-20.185; GND1 -5.05,-13.835; GND2 -5.05,-16.375; GND3 -5.05,-18.915; ID -10.95,-16.375; IRQ -10.95,-13.835; SCL -10.95,-17.645; SDA -10.95,-18.915; VBUS -10.95,-20.185; WAKEUP -10.95,-15.105 | smd 2.5 x 1.2 bottom: H1 -10.55,-22.8; H2 -5.45,-22.8; H3 -5.45,-11.2; H4 -10.55,-11.2 | hole 1.6: -8,-11.615; -8,-22.385
CORTEX-DEBUG = smd 0.8 x 3: GND1 -1.27,-2; GND2 0,-2; GND_DETECT 2.54,-2; NC/TDI 1.27,2; NRESET 2.54,2; SWCLK/TCK -1.27,2; SWDIO/TMS -2.54,2; SWO/TDO 0,2; VCC -2.54,-2
1X04 = drill 1.016 long: 1 -3.81,0; 2 -1.27,0; 3 1.27,0; 4 3.81,0
XTAL_5032 = smd 1.8 x 1.4: 1 -1.7,-1; 2 1.7,-1; 3 1.7,1; 4 -1.7,1

### Placement (x,y rotation side)
BRD1  0,0 0 top
C1  19.6,11.8 90 top
C2  4.2,8.2 180 top
C3  17.8,25.8 270 top
C4  22.8,25.8 90 top
C5  21.2,22.2 270 top
C6  4.2,13.2 180 top
C7  6.4,30 180 top
C8  6.4,28.2 180 top
C9  22.8,11.8 270 top
C10  27,11.8 90 top
C11  25.2,25.8 270 top
C12  30.2,25.8 90 top
C13  28.6,22.2 270 top
C14  30.2,11.8 270 top
C15  34.4,11.8 90 top
C16  32.6,25.8 270 top
C17  37.6,25.8 90 top
C18  36,22.2 270 top
C19  37.6,11.8 270 top
C20  41.8,11.8 90 top
C21  40,25.8 270 top
C22  45,25.8 90 top
C23  43.4,22.2 270 top
C24  45,11.8 270 top
C25  18.6,14.2 0 top
C26  26,14.2 0 top
C27  33.4,14.2 0 top
C28  40.8,14.2 0 top
C29  32,68.4 0 top
C30  28,68.4 0 top
C31  24,68.4 0 top
C32  20,68.4 0 top
C33  12.6,44.8 180 top
C34  12,51.4 0 top
C35  20.2,35 180 top
C36  35,37.6 0 top
C37  37.4,54.6 0 top
C38  16.4,57.8 180 top
C39  20.2,36.6 180 top
C40  35,39.2 0 top
C41  37.4,53.2 0 top
C42  16.4,56.2 180 top
C43  12.6,39.2 180 top
C44  12.6,42.4 180 top
C45  12.6,40.8 180 top
C46  8.8,46.8 180 top
C47  8.8,45.2 180 top
C48  8.8,43.6 180 top
C49  13.6,69.6 270 top
C50  11.4,69.6 270 top
C51  15.6,77.6 0 top
C52  19.6,72.6 90 top
C53  20,76.8 90 top
C54  31.8,74.8 270 top
C55  24.8,74.8 270 top
C56  5.4,46.4 270 top
C57  4.4,43.4 0 top
C58  3.4,35.4 270 top
C59  5.4,35.2 270 top
C60  10.2,33.6 270 top
C61  7.8,59 180 top
C62  7.8,57 180 top
CH1  17,2.4 0 top
CH2  25,2.4 0 top
CH3  33,2.4 0 top
CH4  41,2.4 0 top
D1  26.6,9 0 top
D2  34,9 0 top
D3  19.2,9 0 top
D4  7.4,6 180 top
D5  41.4,9 0 top
D6  36.6,74.6 90 top
GPS  9,2.4 0 top
IC1  25.6,47.2 270 top
IC2  18.6,22 0 top
IC3  8.4,21 90 top
IC4  18.6,17.2 0 top
IC5  26,17.2 0 top
IC6  26,22 0 top
IC7  33.4,17.2 0 top
IC8  33.4,22 0 top
IC9  40.8,17.2 0 top
IC10  40.8,22 0 top
IC11  32,63.4 0 top
IC12  28,63.4 0 top
IC13  24,63.4 0 top
IC14  20,63.4 0 top
IC15  LM3671MF-ADJ  [SOT23-5']  16.6,72.6 0 top
IC16  4.2,39.4 180 top
IC17  13.8,36 270 top
IC18  ADR361  [SOT23-5'']  8.8,40.6 0 top
L1  17.8,11.8 270 top
L2  9.2,7.8 0 top
L3  25.2,11.8 270 top
L4  32.6,11.8 270 top
L5  40,11.8 270 top
L6  12.6,73.2 180 top
L7  3.4,46.4 90 top
L8  8.6,61.6 90 top
PTC1  36.4,69 90 top
Q1  12.4,10.8 180 top
Q2  9,11.8 180 top
R1  21.2,15.2 90 top
R2  21.2,11.8 270 top
R3  22.8,18.6 270 top
R4  22.8,22.2 90 top
R5  21.2,25.8 90 top
R6  19.4,25.8 270 top
R7  21.2,18.6 90 top
R8  5,10.8 90 top
R9  12.4,7.8 0 top
R10  12.4,13.8 180 top
R11  22.8,15.2 90 top
R12  28.6,11.8 270 top
R13  30.2,22.2 90 top
R14  28.6,25.8 90 top
R15  26.8,25.8 270 top
R16  28.6,15.2 90 top
R17  30.2,18.6 270 top
R18  28.6,18.6 90 top
R19  30.2,15.2 90 top
R20  36,11.8 270 top
R21  37.6,22.2 90 top
R22  36,25.8 90 top
R23  34.2,25.8 270 top
R24  36,15.2 90 top
R25  37.6,18.6 270 top
R26  36,18.6 90 top
R27  37.6,15.2 90 top
R28  43.4,11.8 270 top
R29  45,22.2 90 top
R30  43.2,25.8 90 top
R31  41.6,25.8 270 top
R32  43.4,15.2 90 top
R33  45,18.6 270 top
R34  43.4,18.6 90 top
R35  45,15.2 90 top
R36  12.6,46.4 180 top
R37  25,57.8 180 top
R38  13.4,49.2 270 top
R39  15.6,76 180 top
R40  18.2,76.8 270 top
R41  9.4,36.2 180 top
R42  8.4,33.6 90 top
R43  4.6,53 90 top
X5  50,80 0 top
X6  50,80 0 top
X8  42.4,39 90 top
X9  44.2,49.2 270 top
XO1  7.8,53 270 top

### Tracks (layer width: path | path; a pad name or v marks a point on that pad's centre or on a via)
+5V  (via drill 0.3)
  Top 0.2: X9.1 | 36.58,67.4 PTC1.1
  Top 0.406: 40.22,59.81 41.2,60.8 41.2,66.8 40.6,67.4 36.58,67.4
  Top 0.61: X5.VBUS 39.98,59.81 | 39.98,59.81 v40,59.8 | v11.8,48.2 7.4,48.2 6.55,47.35 C56.1 5.35,47.4 L7.2 | v21.8,49 v28.4,49 | v43,58.8 46.4,58.8 47,58.2 47,55.81 X9.1 | 39.98,59.81 40.22,59.81 | v36.6,51 40,51 42,53 X9.1
  Bottom 0.61: X5.VBUS 39.98,59.81 | 39.98,59.81 v40,59.8 | v11.8,48.2 14,48.2 14.4,48.6 16.6,48.6 17,49 v21.8,49 | v28.4,49 34.6,49 v36.6,51 | 39.98,59.81 41.98,59.81 v43,58.8
ADC1_CH3
  Top 0.2: 17.8,41.15 IC1.25 arc-50 17.6,40 arc40 16.8,37.4 arc0 17,32.8 17,25.2 17.25,24.95 C3.2 17.91,24.95 IC2.4 17.65,21.41 IC2.1
ADC1_CH4
  Top 0.2: IC4.1 17.65,16.65 18.6,17.6 18.6,19 19.2,19.6 21.05,19.6 R7.2 21.2,19.6 22.4,20.8 22.4,20.95 R4.1 23.55,21.35 23.8,21.6 23.8,27.4 23,28.2 19.4,28.2 18.6,29 18.6,31.4 arc17 18.2,34 arc-20 17.8,38.2 arc-86 19.15,39.45 IC1.26
ADC2_CH3
  Top 0.2: IC6.4 26.84,23.31 | IC1.31 22.1,38.3 arc45 22.8,36.6 arc-44 23.8,34.2 arc-1 23.8,28.8 24.4,28.2 24.4,25.8 25.2,25 C11.2 25.31,24.95 IC6.4 | IC6.1 25.05,21.41 IC6.4
ADC2_CH4
  Top 0.2: IC5.1 25.05,16.65 26,17.6 26,19 26.6,19.6 28.45,19.6 R18.2 28.6,19.75 R13.1 31.15,21.35 31.4,21.6 31.4,27.6 30.8,28.2 26,28.2 25.4,28.8 25.4,32.6 arc53 23.4,36.6 arc-53 22.6,38.2 IC1.32
ADC3_CH1
  Top 0.2: IC1.36 24.6,38.2 arc58 25.6,36.4 arc-7 30.4,33 arc-55 31.2,31.2 31.2,28.6 31.8,28 31.8,25.6 32.45,24.95 C16.2 32.71,24.95 IC8.4 32.45,21.41 IC8.1
ADC3_CH2
  Top 0.2: IC7.1 32.45,16.65 33.4,17.6 33.4,19 34,19.6 35.85,19.6 R26.2 36,19.75 R21.1 38.35,21.35 38.6,21.6 38.6,27.4 37.8,28.2 33.6,28.2 32.8,29 32.8,31.2 arc53 31.4,34 arc9 27.6,36.4 arc-58 26.6,38.2 IC1.40
ADC4_CH1
  Top 0.2: IC1.45 29.1,38.1 arc62 30,36.6 arc-9 37.4,32.8 arc-58 38.4,31 38.4,28.6 39.2,27.8 39.2,25.6 39.85,24.95 C21.2 40.11,24.95 IC10.4 39.85,21.41 IC10.1
ADC4_CH2
  Top 0.2: IC9.1 39.85,16.65 40.8,17.6 40.8,19.2 41.2,19.6 43.25,19.6 | 43.25,19.6 R34.2 | 43.25,19.6 R29.1 45.15,21.35 46,22.2 46,27.4 45,28.2 40.6,28.2 40,28.8 40,31.2 arc53 38.8,33.6 arc28 31.2,36.8 arc-19 30,37.2 arc-71 29.6,38 IC1.46
DAC1_OUT1  (via drill 0.3)
  Top 0.2: IC1.29 21.1,43.1 19.4,44.8 19.4,45.6 v19.2,45.8 | v10.8,49.2 10.6,49 6,49 4.6,50.4 R43.1
  Bottom 0.2: v19.2,45.8 18,47 15.6,47 15.2,46.6 14.6,46.6 13.8,47.4 11.6,47.4 10.8,48.2 v10.8,49.2
GND  (via drill 0.3)
  Top 0.2: C4.2 v22.8,27.2 | C5.2 v21.2,20.8 | D3.A v21.4,9 | IC4.2 v18.6,16.4 | IC2.2 v18.6,21.2 | C9.2 v22.8,10.2 | C14.2 v30.2,10.2 | D1.A v28.8,9 | IC6.2 v26,21.2 | C12.2 v30.2,27.2 | C13.2 v28.6,20.8 | IC5.2 v26,16.4 | D2.A v36.2,9 | C19.2 v37.6,10.2 | IC7.2 v33.4,16.4 | C17.2 v37.6,27.2 | IC8.2 v33.4,21.2 | C18.2 v36,20.8 | C24.2 v45,10.2 | D5.A v43.6,9 | IC9.2 v40.8,16.4 | IC10.2 v40.8,21.2 | C23.2 v43.4,20.8 | C22.2 v45,27.2 | C25.2 v20,14.2 | C26.2 v27.4,14.2 | C27.2 v34.8,14.2 | C28.2 v42.2,14.2
  other vias: 5.4,4.6 38.8,68.8 40.2,68.8 43.8,68.8 45.2,68.8 38.8,57.2 40.2,57.2 43.8,57.2 45.2,57.2 43.2,63.6 43.2,61.2 43.2,66.2 49,74.4 49,68.2 49,62.2 49,55.8 49,49.2 49,42.4 49,35.2 49,27.6 49,19.2 49,5.4 49,12 1,74.4 1,67.6 1,60.8 1,54 1,47.8 1,41.8 1,34.6 1,28 1,21.2 1,13.6 1,5.8 5.4,79 13,79 20.8,79 29.8,79 37,79 44.4,79 15,5.6 18.2,5.6 16,5.6 21,5.6 24,5.6 26,5.6 32,5.6 29.2,5.6 37,5.6 34,5.6 40,5.6 42,5.6 47,5.6 47,10 47,14.2 47,18.4 15,10 15,14.2 15,18.4 5.6,1 12,1 14,1 20,1 22,1 28,1 30,1 36,1 38,1 44.2,1 3.6,14.6 6.4,14.6 6.6,12.6 6.6,10.8 6.6,9.4 8.8,9.4 10.6,6.4 10.6,5 7,5 6.6,6.6 4.8,6.6 3.4,7 2.2,8.4 3.4,9.6 3.4,11.8 2.2,13.2 10,14.8 11.2,9.8 19.6,30.4 24.6,30.4 32,30.4 26.4,30.4 30.2,30.4 22.8,30.4 21.2,30.4 39.2,30.4 17.8,30.4 15,29.4 19.8,37.8 19.4,34 19.4,35.8 21.4,38 33.8,30.4 37.4,30.4 30.8,38 38.8,32.4 41,30.4 40,33.6 37,37.6 37,39.2 35.8,40.4 44.4,40.2 25.4,41 21.4,45.6 29.8,44.6 30.8,41 35,52 30.4,52 35.2,43.6 40,46.4 40,42.8 14.4,58.8 14.4,57.8 14.4,56.2 15.6,55 20.4,53.2 20.2,56.6 16.6,70.2 17.2,72.6 15.8,72.6 17.8,74.8 19,74.8 21.2,73.2 21,74.8 26.4,78.2 26.4,76.2 23.2,78.2 23.2,76 33.4,78.2 33.4,76.2 35.2,75.6 38,74.6 38,76.4 38.6,70.2 37,66 8.6,74.8 10.2,67.2 11.4,67.2 13.6,67.2 15.2,68 24.6,33.2 22.8,34.8 34.6,35.2 36.8,35.8 23.6,38 25.6,38 27.8,38 26.8,33.8 29.4,34.6 33.8,33.4 19.4,41.2 16.6,40.4 47,30.4 15,23 15,26.8 47,22.2 47,26.2 12.4,24.2 12.8,27.6 6.4,31.2 4.4,30 4.4,28.2 4.2,17.8 6,17.8 12,17.8 11.2,31 13.8,35.6 11.4,36 15.6,38.8 10.8,42.4 6.8,46 6.8,44.4 4.2,39.4 6.4,41.8 22,65.8 30,65.8 30,68.4 26,68.4 22,68.4 32.4,69.6 34.4,68 18,68.6 22.2,57.8 19.8,59 24,59.2 28,57 26,59.2 22,60.6 30,61 32.2,59.2 35,61 23.8,63.4 17.6,63 5.2,55.4 7,60.6 5.4,51 6.8,53 9.8,53 12,49.6 16,49.8 16.6,54.4 8.2,70.8 10.8,40.8 11.2,39.2 8.8,40.6 7,34.6 9.4,31.4 4,33.2 19.4,43.6 16.2,44.2 39.2,53.2 39.2,54.6 34.8,54.4 41.4,54.2 23.6,53 9.4,28.2 20.6,47.8 20.8,50.4 29.2,47.6 42.8,9 35.4,9 28,9 20.6,9 18.2,66.4 42,49.2 37.2,48.8 8.4,24
  pour Top (rank 2): 0,0 50,0 50,80 0,80
  pour Bottom (rank 2): 0,0 50,0 50,80 0,80
GPS_1PPS  (via drill 0.3)
  Top 0.2: v12.4,32.6 11.8,32 11.8,31.6 12.2,31.2 12.2,31 12.6,30.6 12.6,29.8 10.2,27.4 9.8,27.4 9.5,27.1 IC3.4 | IC1.24 16.3,41.7 v16.2,41.6
  Bottom 0.2: v16.2,41.6 15.6,41 15.6,40 16.6,39 16.6,36.6 13.2,33.2 13,33.2 v12.4,32.6 12.2,32.6
GPS_FORCE_ON  (via drill 0.3)
  Top 0.2: IC3.18 12.8,23.2 13.8,24.2 13.8,30.8 14.2,31.2 14.2,31.8 13.6,32.4 v13.2,32.4 | IC1.57 31.6,44.2 31.2,43.8 23,43.8 v22.8,43.6
  Bottom 0.2: v22.8,43.6 21.4,42.2 21.4,41.6 20,40.2 19,40.2 17,38.2 17,36.4 13.6,33 13.6,32.8 v13.2,32.4
I2C3_SCL  (via drill 0.3)
  Top 0.2: v40.4,62.4 40.35,62.35 X6.SCL 37.95,62.35 37,61.4 37,60.2 36.6,59.8 v36.6,59.2 | IC1.67 34.6,49.2 35,49.6 35,51 36.2,52.2 39.6,52.2 40,52.6 40,55.2 39.4,55.8 36.4,55.8 35.8,56.4 v35.6,56.4
  Bottom 0.2: X6.SCL 40.35,62.35 v40.4,62.4 | v36.6,59.2 36.6,58.2 35.6,57.2 v35.6,56.4
I2C3_SDA  (via drill 0.3)
  Top 0.2: v40.4,61.2 40.28,61.09 X6.SDA 38.09,61.09 37.6,60.6 v37.6,59.8 | IC1.66 34.7,48.7 35.4,49.4 35.4,50.8 36.4,51.8 39.8,51.8 40.4,52.4 40.4,55.4 39.6,56.2 36.6,56.2 36.4,56.4 v36.4,56.8
  Bottom 0.2: X6.SDA 40.28,61.09 v40.4,61.2 | v36.4,56.8 36.4,57.4 37,58 37,58.6 37.6,59.2 v37.6,59.8
N$1
  Top 0.2: R2.1 C9.1
N$2
  Top 0.2: IC4.3 21.04,15.89 R1.2
N$3
  Top 0.2: R2.2 C1.1 17.95,10.95 L1.2 17.8,9.05 D3.C 17,8.25 CH1.C
N$4
  Top 0.2: C1.2 19.6,12.75 R1.1 R11.1
N$5
  Top 0.2: R5.1 C4.1 R4.2
N$6
  Top 0.2: R5.2 R6.1 C3.1
N$7
  Top 0.2: IC2.3 19.6,20.74 19.6,21.8 20.05,22.25 C5.1 21.2,23.15 R6.2
N$8
  Top 0.2: IC4.4 20.44,18.51 R7.1 21.2,17.85 R3.1
N$9
  Top 0.2: R12.2 C10.1 25.35,10.95 L3.2 25.2,9.05 D1.C 25,8.85 CH2.C
N$10
  Top 0.61: GPS.C 9,4.4 D4.C L2.1 7,8 C2.1 5.05,9.9 R8.1
N$11
  Top 0.61: R8.2 5.05,11.7 C6.1 5.1,13.25 IC3.11
N$12
  Top 0.2: L2.2 R9.1
N$13
  Top 0.2: Q1.2 11.55,12 R10.2 11.35,14 9.4,14 8.4,15 IC3.14
N$14
  Top 0.2: R9.2 13.25,8.85 Q1.3
N$15
  Top 0.2: Q2.3 9.1,10.8 12.4,10.8 13.35,11.75 Q1.1 13.25,12 R10.1
N$16
  Top 0.2: IC3.13 7.3,15.5 9.9,12.9 Q2.1
N$17
  Top 0.2: R13.2 C12.1 R14.1
N$18
  Top 0.2: R14.2 R15.1 C11.1
N$19
  Top 0.2: IC6.3 26.95,21.4 C13.1 28.6,23.15 R15.2
N$20
  Top 0.2: IC5.4 27.84,18.51 R18.1 28.6,17.85 R17.1
N$21
  Top 0.2: R16.2 27.11,16.05 IC5.3
N$22
  Top 0.2: C14.1 R12.1
N$23
  Top 0.2: C10.2 27,12.75 R16.1 R19.1
N$24
  Top 0.2: R20.2 C15.1 32.75,10.95 L4.2 32.55,10.75 D2.C 33,8.55 CH3.C
N$25
  Top 0.2: R22.1 C17.1 R21.2
N$26
  Top 0.2: C16.1 R23.1 R22.2
N$27
  Top 0.2: R23.2 34.55,24.6 34.6,24.6 36,23.4 C18.1 34.35,21.6 IC8.3
N$28
  Top 0.2: R25.1 36,17.85 R26.1 35.24,18.51 IC7.4
N$29
  Top 0.2: IC7.3 35.84,15.89 R24.2
N$30
  Top 0.2: R20.1 C19.1
N$31
  Top 0.2: R27.1 R24.1 34.4,12.75 C15.2
N$32
  Top 0.2: R28.2 C20.1 40.15,10.95 L5.2 39.95,10.75 D5.C 41,7.95 CH4.C
N$33
  Top 0.2: R30.1 C22.1 R29.2
N$34
  Top 0.2: R30.2 R31.1 C21.1
N$35
  Top 0.2: IC10.3 41.75,21.4 C23.1 43.4,23.15 R31.2
N$36
  Top 0.2: IC9.4 42.64,18.51 R34.1 43.4,17.85 R33.1
N$37
  Top 0.2: IC9.3 43.24,15.89 R32.2
N$38
  Top 0.2: C24.1 R28.1
N$39
  Top 0.2: R35.1 R32.1 41.8,12.75 C20.2
N$40
  Top 0.2: IC1.94 22.6,56.2 23.8,57.4 23.8,57.45 R37.2
N$41
  Top 0.2: IC1.13 16.4,47.2 15.4,48.2 13.4,48.2 R38.2
N$42
  Top 0.2: C51.2 R39.1 | R39.1 18.15,76 R40.2 C53.1 | IC15.4 17.55,74.05 16.6,75 16.6,75.85 R39.1
N$43
  pour Top (no thermals): 16.2,73.6 16.2,74.2 15.8,74.6 13,74.6 12.8,74.4 12.8,72 13,71.8 14.6,71.8 14.8,72 14.8,72.8 15.4,73.4 16,73.4
N$44
  Top 0.61: IC16.3 3.25,42 | 3.25,42 3.25,43.2 C57.1 3.4,43.45 L7.1 | IC16.1 5.15,41.65 4.8,42 3.25,42
N$45
  Top 0.2: IC16.4 3.25,36.4 C58.1
N$46
  Top 0.2: C60.1 R42.2 | IC17.3 11.65,35.05 11,34.4 10.25,34.4 C60.1 | C60.1 10.2,36.15 R41.1
N$47
  Top 0.2: 8.9,51.2 XO1.3 8.9,51.4 C34.1
N$48
  Top 0.2: L8.1 8.65,60.55 C61.1 C62.1 8.65,54.85 XO1.4
N$49
  Top 0.2: XO1.1 5.45,54.7 R43.2
NRST  (via drill 0.3)
  Top 0.2: C33.1 R36.1 15.8,46.4 16.1,46.7 IC1.14 21.5,46.7 22,47.2 27.4,47.2 v27.8,46.8 | X8.NRESET 39.26,41.54 38.8,42 38.8,44 36.8,46 35,46 v34.8,46.2
  Bottom 0.2: v27.8,46.8 31,46.8 31.2,46.6 34.4,46.6 v34.8,46.2
SPI1_MISO_MOSI  (via drill 0.3)
  Top 0.2: X6.DATA 43.65,62.35 v43.6,62.4 43,62.4 42.2,61.6 42.2,60.2 40.6,58.6 37.6,58.6 37,58 35.6,58 34,56.4 34,55.4 32,53.4 31.6,53.4 31.4,53.2 24.6,53.2 | IC1.91 24.1,53.7 24.6,53.2 | IC1.90 24.6,53.2
  Bottom 0.2: X6.DATA 43.65,62.35 v43.6,62.4
SPI1_NSS  (via drill 0.3)
  Top 0.2: X6.FRAME 43.62,59.81 v43.6,59.8 42.4,59.8 40.8,58.2 37.8,58.2 37.2,57.6 35.8,57.6 34.4,56.2 34.4,55.2 33.6,54.4 v33.6,54 | IC1.77 31.1,55.9 31.4,56.2 32.4,56.2 v32.8,55.8
  Bottom 0.2: X6.FRAME 43.62,59.81 v43.6,59.8 | v32.8,55.8 32.8,55.6 33,55.4 33,54.6 v33.6,54
SPI1_SCK  (via drill 0.3)
  Top 0.2: X5.CLK 43.7,64.89 v43.6,65 42.8,65 41.8,64 41.8,60.4 40.4,59 37.4,59 36.8,58.4 35.4,58.4 33.6,56.6 33.6,55.6 31.8,53.8 31.4,53.8 31.2,53.6 25.4,53.6 25.1,53.9 IC1.89
  Bottom 0.2: X5.CLK 43.7,64.89 v43.6,65
SPI4_MISO  (via drill 0.3)
  Top 0.2: IC1.4 16.7,51.7 15.2,53.2 14.4,53.2 12.6,55 12.6,60.6 v13.2,61.2 | IC11.2 31.68,61.52 31.2,62 27.6,62 | 27.6,62 23.6,62 | 23.6,62 19.6,62 | 19.6,62 18.6,62 v17.2,60.6 | IC14.2 19.68,61.92 19.6,62 | IC13.2 23.68,61.92 23.6,62 | IC12.2 27.68,61.92 27.6,62
  Bottom 0.2: v17.2,60.6 14.8,60.6 14.6,60.8 13.6,60.8 v13.2,61.2
SPI4_MOSI  (via drill 0.3)
  Top 0.2: IC1.5 16.6,51.2 15,52.8 14.2,52.8 12.2,54.8 12.2,61.2 13,62 14.4,62 v17.8,65.4 | 25,65 v21,65 20.98,65.03 IC14.5 | 25,65 26,65 26.4,64.6 28,64.6 28.4,65 29,65 | 29,65 32.6,65 32.98,65.38 IC11.5 | IC12.5 28.98,65.03 29,65 | IC13.5 24.98,65.03 25,65
  Bottom 0.2: v21,65 18.2,65 v17.8,65.4
SPI4_SCK  (via drill 0.3)
  Top 0.2: IC1.1 15.8,53.2 15.4,53.6 14.6,53.6 13,55.2 13,60 17.6,64.6 20.32,64.6 | IC14.6 20.32,64.6 | 20.32,64.6 20.32,64.47 20.6,64.2 21.2,64.2 21.6,64.6 25.4,64.6 v25.8,64.2 28.2,64.2 28.6,64.6 32.8,64.6 33.6,65.4 33.6,67 33.2,67.4 32.6,67.4 32.33,67.12 IC11.6 | IC12.6 28.32,65.53 28,65.2 26.6,65.2 26.2,65.6 v26.2,65.8 26.2,67 25.8,67.4 24.6,67.4 24.32,67.12 IC13.6
  Bottom 0.2: v26.2,65.8 25.8,65.4 v25.8,64.2
SRAM1_CS
  Top 0.2: IC1.92 23.6,56 23.8,56.2 29,56.2 31.02,58.23 IC11.1
SRAM2_CS
  Top 0.2: IC1.93 23.1,56.1 23.6,56.6 26.4,56.6 27.02,57.23 IC12.1
SRAM3_CS
  Top 0.2: IC1.95 22.1,56.3 23.02,57.23 IC13.1
SRAM4_CS
  Top 0.2: IC1.96 21.6,57 20.6,58 19.6,58 19.02,58.58 IC14.1
SWCLK  (via drill 0.3)
  Top 0.2: X8.SWCLK/TCK 38.67,37.73 38.4,38 38.4,43.8 36.6,45.6 35.4,45.6 v35,45.2 | v32.2,55.2 31.85,55.2 IC1.76 | v31.6,52 31.6,51.6 31.8,51.4 31.8,51 30.8,50 30.8,49.2 30.4,48.8 30.4,48 30.2,47.8 30.2,46.4 30,46.2 30,45.6 30.4,45.2 31.4,45.2 v32,45.8
  Bottom 0.2: v32.2,55.2 32.2,52.6 v31.6,52 | v35,45.2 32.6,45.2 v32,45.8
SWDIO  (via drill 0.3)
  Top 0.2: X8.SWDIO/TMS 38.74,36.46 38,37.2 38,43.6 36.6,45 35.8,45 35.2,44.4 v34.8,44.4 | IC1.72 32.5,51.7 32.2,51.4 32.2,50.8 31.2,49.8 31.2,49 30.8,48.6 30.8,47.8 30.6,47.6 30.6,46.2 v30.8,46
  Bottom 0.2: v34.8,44.4 34.4,44.8 32,44.8 v30.8,46
TCXO_CLK
  Top 0.2: IC1.12 16.5,47.7 14.4,49.8 13.4,49.8 R38.1 13.4,51.15 C34.2
USART1_RX  (via drill 0.3)
  Top 0.2: v35,47 35.8,47 36.2,47.4 39.4,47.4 40.4,48.4 43.73,48.4 X9.3 | IC1.69 32.2,50.2 31.6,49.6 31.6,48.8 31.2,48.4 31.2,47.6 v31.4,47.4
  Bottom 0.2: v35,47 31.8,47 v31.4,47.4
USART1_TX  (via drill 0.3)
  Top 0.2: v35.4,47.8 39.2,47.8 41.8,50.4 43.2,50.4 43.4,50.6 44.07,50.6 X9.2 | IC1.68 32.3,49.7 32,49.4 v32,48
  Bottom 0.2: v35.4,47.8 34.8,47.8 34.4,47.4 32.6,47.4 v32,48
USART3_RX  (via drill 0.3)
  Top 0.2: IC1.56 31.7,43.7 31.4,43.4 24.2,43.4 23.8,43 v23.4,43 | v13.4,31.4 13.4,29.4 11.7,27.7 IC3.2
  Bottom 0.2: v23.4,43 23,42.6 22.4,42.6 21.8,42 21.8,41.4 20.2,39.8 19.2,39.8 17.4,38 17.4,36.2 14,32.8 14,32 v13.4,31.4
USART3_TX  (via drill 0.3)
  Top 0.2: IC1.55 31.8,43.2 31.6,43 24.4,43 23.8,42.4 v23.8,42.2 | v12.6,31.8 12.6,31.2 13,30.8 13,29.6 10.6,27.2 IC3.3
  Bottom 0.2: v23.8,42.2 22.6,42.2 22.2,41.8 22.2,41.2 20.4,39.4 19.4,39.4 17.8,37.8 17.8,36 14.4,32.6 14.4,31.2 13.8,30.6 13,30.6 12.6,31 v12.6,31.8
UXB_ID  (via drill 0.3)
  Top 0.2: v40.4,63.6 40.38,63.62 X6.ID 38.02,63.62 37.8,63.4 37.8,62.8 36.6,61.6 36.6,60.4 36.2,60 36.2,59.8 33,56.6 31.2,56.6 30.6,56 IC1.78
  Bottom 0.2: X6.ID 40.38,63.62 v40.4,63.6
UXB_IRQ  (via drill 0.3)
  Top 0.2: v40.4,66.2 40.37,66.17 X6.IRQ 38.16,66.17 37.8,65.8 37.8,65.4 37.2,64.8 37.2,64 37,63.8 37,63.2 35.8,62 35.8,60.8 35.4,60.4 35.4,60.2 32.6,57.4 30.8,57.4 29.6,56.2 IC1.80
  Bottom 0.2: X6.IRQ 40.37,66.17 v40.4,66.2
UXB_WAKEUP  (via drill 0.3)
  Top 0.2: v40.4,65 40.3,64.89 X6.WAKEUP 37.9,64.89 37.6,64.6 37.6,63.8 37.4,63.6 37.4,63 36.2,61.8 36.2,60.6 35.8,60.2 35.8,60 32.8,57 31,57 30.1,56.1 IC1.79
  Bottom 0.2: X6.WAKEUP 40.3,64.89 v40.4,65
VBUS
  Top 0.61: IC15.1 15.65,69.75 16.2,69.2 17.2,69.2 17.8,69.8
  pour Top (no thermals): 18.6,72.4 21.8,72.4 23.8,74.4 37,74.4 37.6,73.8 37.6,69.6 37.2,69.2 35,69.2 33.6,70.6 18.8,70.6 17.8,69.6 17.4,69.6 17.4,71.8 18,72.4
VCC  (via drill 0.3)
  Top 0.2: IC14.8 19.02,68.28 | 19.02,68.28 C32.1 19.2,68.45 19.2,69.2 19.8,69.8 23,69.8 | IC13.8 23.02,68.28 | 23.02,68.28 C31.1 | IC12.8 27.02,68.28 C30.1 27.15,69.65 27,69.8 | IC11.8 31.02,68.28 | 31.02,68.28 C29.1 | 31.02,68.28 31.02,69.38 30.6,69.8 27,69.8 | 27,69.8 23,69.8 | 23.02,68.28 23.02,69.78 23,69.8 | IC1.28 20.6,37.25 C39.1 C35.1 v20.6,35 | X8.VCC 43.26,36.46 42.4,35.6 38.8,35.6 37.8,36.6 35.15,36.6 C36.1 C40.1 32.8,39.2 32.55,39.45 IC1.50 | C37.1 C41.1 36.35,53.4 34.6,53.4 34.4,53.2 IC1.75 32.4,53.2 32.2,53 31.8,53 31.6,52.8 24.6,52.8 23.8,52 19.4,52 | IC1.100 19.6,56 19.2,56.4 17.45,56.4 C42.1 | 19.02,68.28 18.88,68.28 18.4,67.8 16.6,67.8 15,69.4 15,69.8 14.6,70.2 | L8.2 8.6,68.6 10,70 | 7.3,28.15 C8.1 | R36.2 11.8,46.4 12.8,47.4 v15,47.4 | IC1.6 19.3,50.7 19.4,50.8
  Top 0.406: IC3.8 5.1,24.3 5.6,23.8 6.8,23.8 7.3,24.3 IC3.6 7.3,28.15 | C8.1 C7.1 11.6,30 v11.8,30.2 | v23.2,41.2 24,41.2 25.2,42.4 31.6,42.4 32,42 32,41 32.4,40.6 33.6,40.6 34.15,40.05 C40.1 | 22.1,43.1 22,43.2
  Top 0.61: v14.2,60 15.8,60 17.25,58.55 C38.1 C42.1 17.4,56.05 17.4,55.4 19.4,53.4 19.4,52 19.4,50.8 v19.4,47.6 | v11,60.8 11,62.2 9.2,64 9.2,68.4 10,69.2 10,70 10.2,70.2 | v23.2,41.2 22.8,41.6 22.8,42.4 22.1,43.1 20.2,45 v20.2,46
  Bottom 0.2: v15,47.4 15.2,47.6 v19.4,47.6
  Bottom 0.406: 18.2,35.6 15,32.4 15,31 14,30 12,30 v11.8,30.2 | 18.2,35.6 18.4,35.8 18.4,37.6 19.6,38.8 20.8,38.8 v23.2,41.2 | v20.6,35 18.8,35 18.2,35.6
  Bottom 0.61: v14.2,60 11.8,60 v11,60.8 | v19.4,47.6 19.4,46.8 v20.2,46
  pour Top (no thermals): 13.6,69.8 14.6,69.8 15,70.2 15,70.8 14.6,71.2 12.8,71.2 12.2,71.8 12.2,74.6 12.8,75.2 15,75.2 15.4,75.6 15.4,78 15,78.4 10.8,78.4 9.4,77 9.4,70.6 10.2,69.8
VDDA
  Top 0.2: IC6.5 25.05,22.25 24.4,21.6 24.4,19.16 IC5.5 24,17.46 24,15 24.8,14.2 C26.1 25.2,14.15 L3.1 25.2,11.8 | IC8.5 32.45,22.45 31.8,21.8 31.8,19.16 IC7.5 31.4,17.46 31.4,15 32.2,14.2 C27.1 32.6,14.15 L4.1 32.6,11.8 | IC10.5 39.85,22.45 39.2,21.8 39.2,19.16 IC9.5 38.8,17.46 38.8,15 39.6,14.2 C28.1 40,14.2 L5.1 39,11.8 32.6,11.8 | 32.6,11.8 25.2,11.8 | 25.2,11.8 18.8,11.8 L1.1 17.8,14.15 C25.1 17.4,14.2 16.6,15 16.6,16.8 16.2,17.2 16.2,17.8 17,18.6 | 17,18.6 17.56,18.6 IC4.5 | 17,18.6 17,21.6 17.65,22.25 IC2.5 17.09,23.31 16.8,23.6 16.8,24.6 16.6,24.8 16.6,31.4 16.2,31.8 16.2,35.86 IC17.5 | IC1.22 14.7,42.7 14.2,42.2
  pour Top (no thermals): 9.8,40.2 10.2,40.2 10.4,40 10.4,39 11.2,38.2 12.4,38.2 12.8,38.6 12.8,42.8 13,43 14,43 14.2,42.8 14.8,42.8 14.8,38.4 15.8,37.4 15.8,36.8 15.6,36.6 14.6,36.6 13.6,37.6 11.6,37.6 11.2,37.2 8,37.2 6.2,35.4 4.8,35.4 4.4,35.8 4.4,38.6 4.8,39 6.8,39 7.4,38.4 9.2,38.4 9.6,38.8 9.6,40
VDDA/2  (via drill 0.3)
  Top 0.2: R33.2 R35.2 44.15,15.2 42.6,15.2 42.4,15 39.4,15 39.2,15.2 39.2,17 v39.4,17.2 | v23.4,17.8 23.15,17.75 R3.2 R11.2 22.8,16 22,15.2 20.4,15.2 20.2,15 17.2,15 17,15.2 v17,17.4 | v24.6,17.2 24.4,17 24.4,15.2 24.6,15 27.6,15 27.8,15.2 29.35,15.2 R19.2 R17.2 30.55,17.75 v30.8,17.8 | v32,17.2 31.8,17 31.8,15.2 32,15 35,15 35.2,15.2 36.75,15.2 R27.2 R25.2 38.15,17.75 v38.2,17.8 | v16.2,18.8 16.4,19 16.4,24.4 16.2,24.6 16.2,31.2 15.8,31.6 15.8,34.36 IC17.4 15.11,35.89 14.8,36.2 14.4,36.2 13.65,36.95 IC17.1
  Bottom 0.2: v17,17.4 17,18.4 v16.2,18.8 | v24.6,17.2 24,17.2 v23.4,17.8 | v32,17.2 31.4,17.2 v30.8,17.8 | v39.4,17.2 38.8,17.2 v38.2,17.8
VREF  (via drill 0.3)
  Top 0.2: IC1.21 14.4,43.2 14.2,43.4 9.85,43.4 C48.1 | C48.1 C47.1 C46.1 | C48.1 9.75,43.5 IC18.4 9.8,41.7 v9.8,41.2 | R41.2 v9,36.2
  Bottom 0.2: v9,36.2 9.4,36.2 10,36.8 10,41 v9.8,41.2

### Text on the board
bNames: (c) 2017 qyx@krtko.org, CC-BY-SA | GPS synchronized signal digitizer | kiwi-basic-1.0.0+20170723